# Altium project Longboard_32bit_ext.PrjPCB (part 1 of 6)
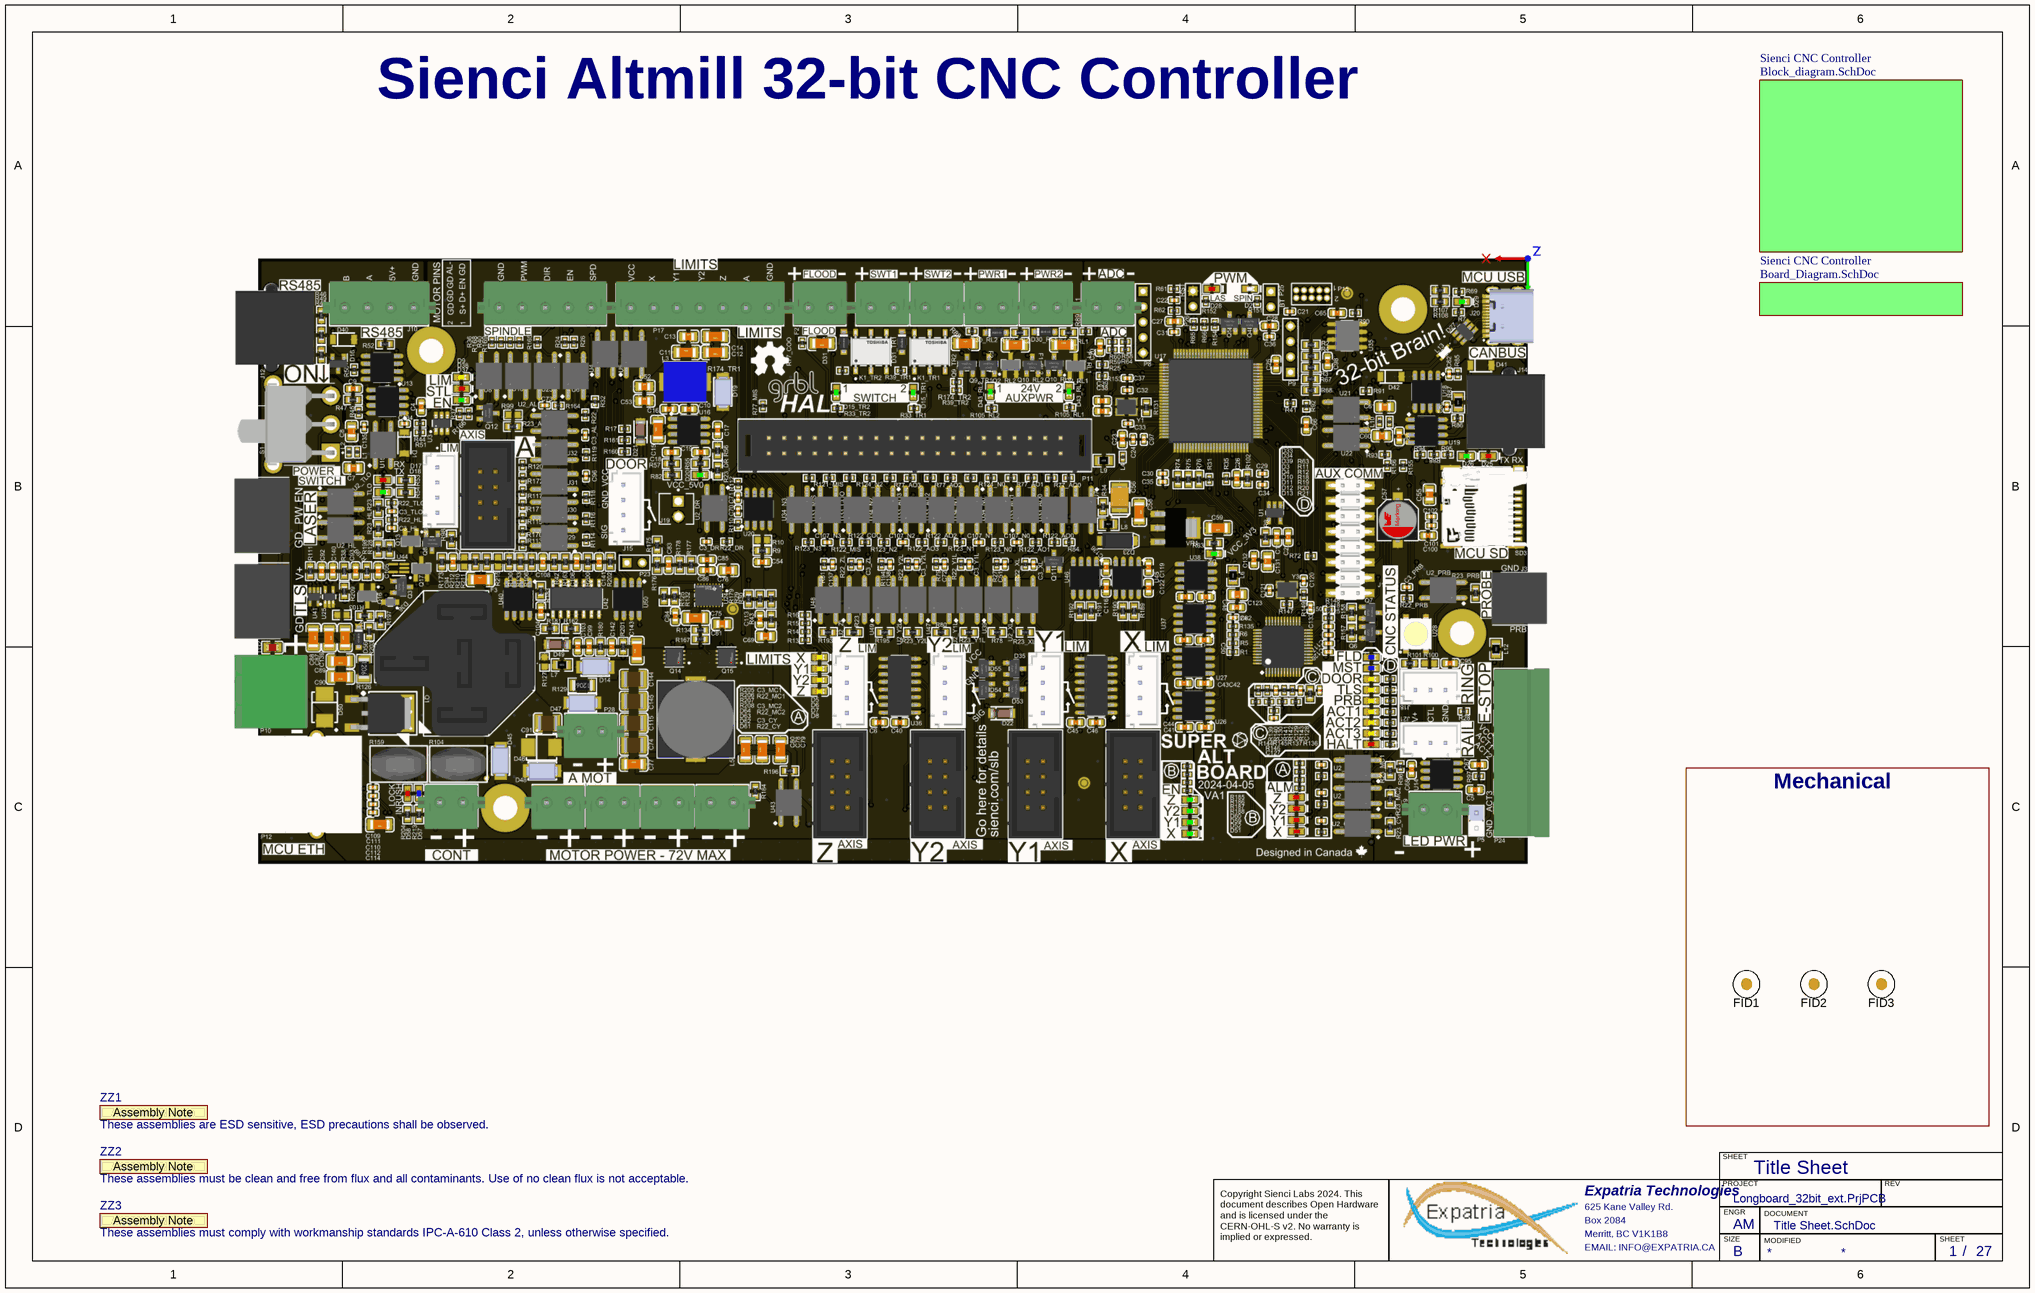
[diagram p0: Title Sheet.SchDoc]
VarRevNo: B9; Title: Sienci Longboard Ext; PCBREVNO: B9; PCBPARTNO: Sienci Longboard Ext
27 sheets, 722 parts. Net scope: hierarchical (ports join the sheet entries above them; power ports are global).
Board file: Longboard_32bit_ext.pcbdoc
Sheets:
  Title Sheet.SchDoc
    Sienci CNC Controller = Block_diagram.SchDoc
      Motion Control MCU = Longboard_32bit.SchDoc
        Microcontroller = MCU_STM32F412VGT6.SchDoc
          Keypad_layout = I2C_Keypad.SchDoc
      Limit and Homing Inputs = Limit_Switches.SchDoc
        TLO = Photocoupler12Vinput.SchDoc
        PRB = Photocoupler12Vinput.SchDoc
        XL = Photocoupler12Vinput.SchDoc
        Y1L = Photocoupler12Vinput.SchDoc
        Y2L = Photocoupler12Vinput.SchDoc
        ZL = Photocoupler12Vinput.SchDoc
        AL = Photocoupler12Vinput.SchDoc
        DR = Photocoupler12Vinput.SchDoc
      User Inputs = Misc_switches.SchDoc
        CY = Photocoupler12Vinput.SchDoc
        MC1 = Photocoupler12Vinput.SchDoc
        HL = Photocoupler12Vinput.SchDoc
        MC2 = Photocoupler12Vinput.SchDoc
      Analog/PWM/Laser Interface = Spindle_Control.SchDoc
      RS485 Interface = RS485.SchDoc
      Offboard Processing = Ethernet_Interface.SchDoc
      DC Power Regulation = DC_Power_Regulation.SchDoc
        5V_Supply = 5V_Power_Supply.SchDoc
        24V_Supply = 24V_Power_Supply.SchDoc
        DC_SW = DC_Power_Switching.SchDoc
      Stepper Drivers = Stepper_driver_group.SchDoc
      Additional IO = Aux_Outputs.SchDoc
        RL1 = Relay_Driver.SchDoc
        RL2 = Relay_Driver.SchDoc
        LED = Neopixel_Driver.SchDoc
        TR1 = Transistor_Driver.SchDoc
        MOT = External_Stepper.SchDoc
        AO0 = 5V_Digital_Out.SchDoc
        AO1 = 5V_Digital_Out.SchDoc
        AO2 = 5V_Digital_Out.SchDoc
        AO3 = 5V_Digital_Out.SchDoc
        COO = 5V_Digital_Out.SchDoc
        MIS = 5V_Digital_Out.SchDoc
        N0 = 3V3_Digital_Out.SchDoc
        N1 = 3V3_Digital_Out.SchDoc
        N2 = 3V3_Digital_Out.SchDoc
        N3 = 3V3_Digital_Out.SchDoc
        TR2 = Transistor_Driver.SchDoc
      Pendant RT Interface (optional) = CANBUS_Pendant.SchDoc
      U_Change Log = Change Log.SchDoc
      Basic USB Stream = USB_Connector.SchDoc
    Sienci CNC Controller = Board_Diagram.SchDoc

## Sheet Title Sheet.SchDoc: STM32F412 CNC
size B; Author: AM; CompanyName: Expatria Technologies; DrawnBy: A.Marles; Engineer: AM; Organization: Expatria Technolgoies; Address1: PO Box 2084; Address3: Merritt, BC V1K 1B8; Address4: Canada; DocumentNumber: 1; Revision: B9; SheetNumber: 1; SheetTotal: 27

### Parts
FID1  Fiducial  [Fiducial10-20]  (value not drawn)  (no BOM)
FID2  Fiducial  [Fiducial10-20]  (value not drawn)  (no BOM)
FID3  Fiducial  [Fiducial10-20]  (value not drawn)  (no BOM)
ZZ1  These assemblies are ESD sensitive, ESD precautions shall be observed.  [AssemblyNote]  (graphical)
ZZ2  These assemblies must be clean and free from flux and all contaminants. Use of no clean flux is not acceptable.  [AssemblyNote]  (graphical)
ZZ3  These assemblies must comply with workmanship standards IPC-A-610 Class 2, unless otherwise specified.  [AssemblyNote]  (graphical)

### Blocks framed on the sheet
Mechanical: FID1-FID3

### Sub-sheets
Sienci CNC Controller = Block_diagram.SchDoc: no entries
Sienci CNC Controller = Board_Diagram.SchDoc: no entries

### Notes on the sheet
- Sienci Altmill 32-bit CNC Controller
- Title Sheet
- SHEET
- Expatria Technologies
- 625 Kane Valley Rd.
- Box 2084
- Merritt, BC V1K1B8
- PROJECT
- SIZE
- ENGR
- MODIFIED
- DOCUMENT
- REV
- Copyright Sienci Labs 2024. This document describes Open Hardware and is licensed under the CERN-OHL-S v2. No warranty is implied or expressed.
- EMAIL: INFO@EXPATRIA.CA
- B
- /
- (in symbol AssemblyNote) Assembly Note

### Library data of the parts
FID1-FID3 = Fiducial: FIDUCIAL NO ASSEMBLY; Manufacturer 1: NONE; Manufacturer Part Number 1: NONE; Value: Fiducial; Manufacturer: NONE; Manufacturer Part Number: NONE
ZZ1-ZZ3 = AssemblyNote: SymbolCreator: codlsc; SymbolVersion: 2010-05-18; CompType: AssemblyNote; ClassName: AssemblyNote; Publisher: Texas Instruments; LatestRevisionDate: 2012-06-14; LatestRevisionNote: Initial Version; Alternate Manufacturer: -; Alternate PartNumber: -; Parameter 1: *

## Sheet Block_diagram.SchDoc: Sienci Longboard Ext
size C; Author: AM; CompanyName: Expatria Technologies; DrawnBy: A.Marles; Engineer: AM; Organization: Expatria Technolgoies; Address1: PO Box 2084; Address3: Merritt, BC V1K 1B8; Address4: Canada; DocumentNumber: 3; Revision: B9; SheetNumber: 3; SheetTotal: 27
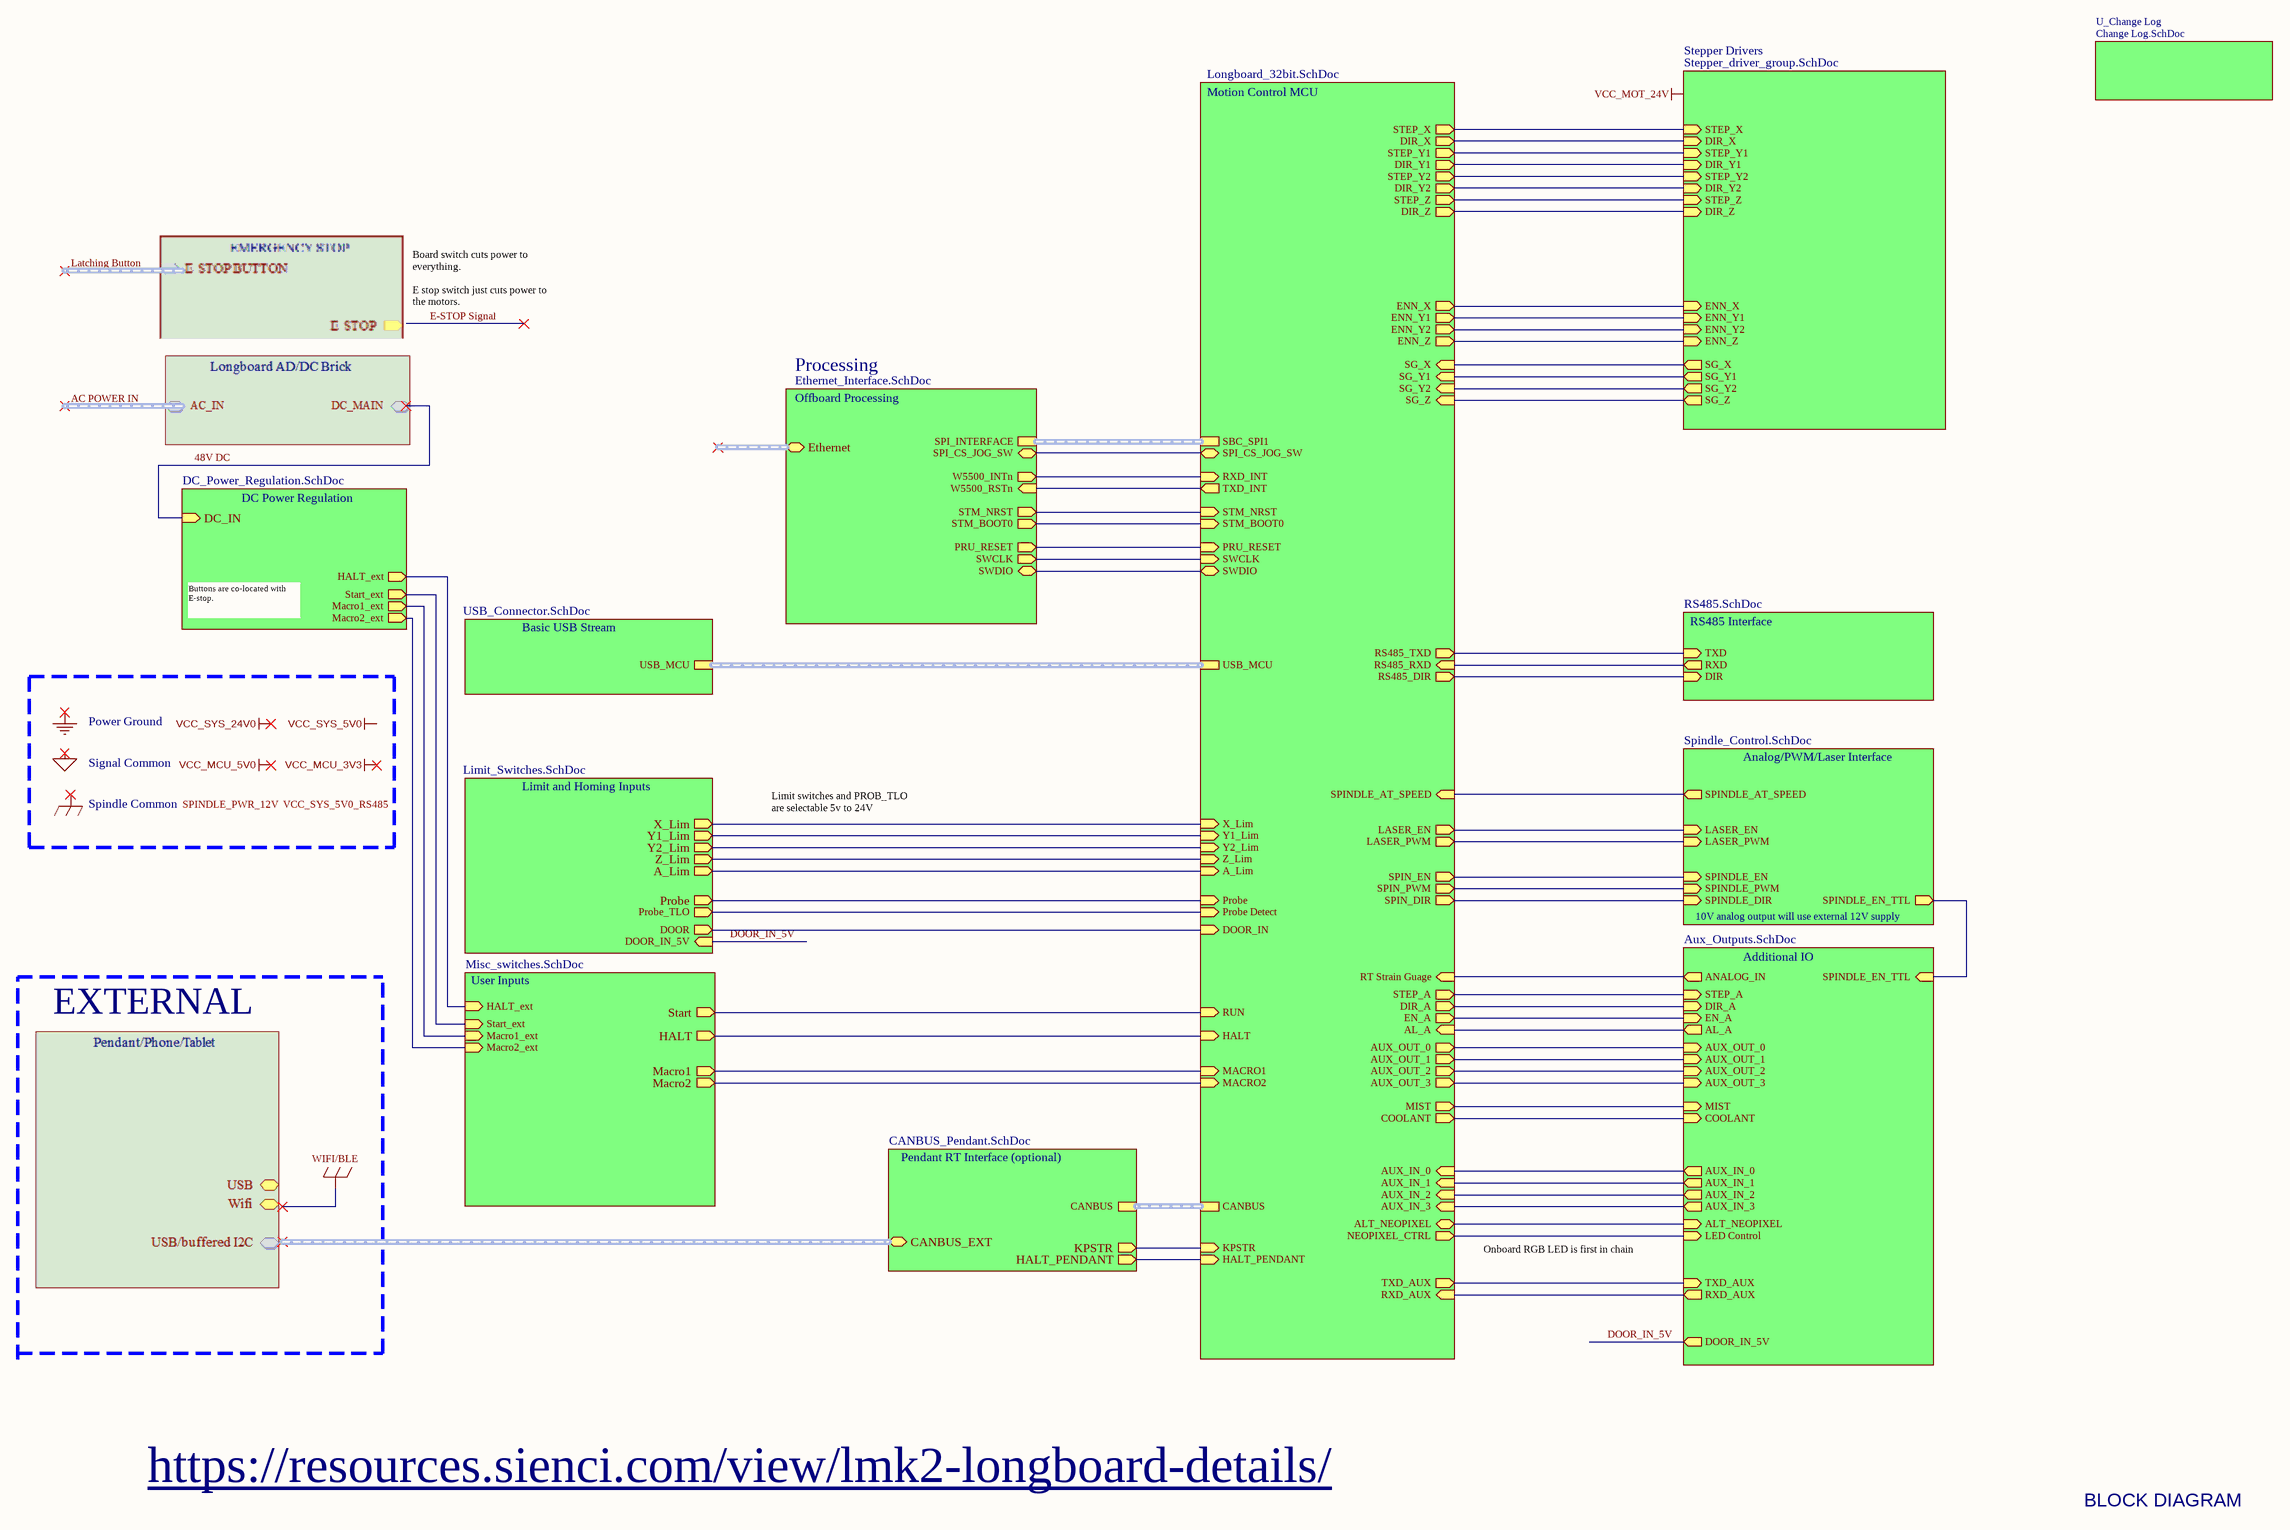
[diagram p1: Block_diagram.SchDoc]

### Sub-sheets
Additional IO = Aux_Outputs.SchDoc: STEP_A (in), DIR_A (in), AUX_OUT_0 (in), AUX_OUT_1 (in), AUX_OUT_2 (in), AUX_OUT_3 (in), AUX_IN_0 (out), AUX_IN_1 (out), AUX_IN_2 (out), AUX_IN_3 (out), LED Control (in), EN_A (in), AL_A (out), RXD_AUX (out), TXD_AUX (in), ANALOG_IN (out), COOLANT (in), MIST (in), SPINDLE_EN_TTL (in), ALT_NEOPIXEL (in), DOOR_IN_5V (out)
Analog/PWM/Laser Interface = Spindle_Control.SchDoc: LASER_PWM (in), LASER_EN (in), SPINDLE_PWM (in), SPINDLE_EN (in), SPINDLE_DIR (in), SPINDLE_AT_SPEED (out), SPINDLE_EN_TTL (out)
Basic USB Stream = USB_Connector.SchDoc: USB_MCU (harness USB2.0)
DC Power Regulation = DC_Power_Regulation.SchDoc: DC_IN (in), Start_ext (out), Macro1_ext (out), Macro2_ext (out), HALT_ext (out)
Limit and Homing Inputs = Limit_Switches.SchDoc: X_Lim (out), Y1_Lim (out), Y2_Lim (out), Z_Lim (out), A_Lim (out), Probe (out), Probe_TLO (out), DOOR (out), DOOR_IN_5V (in)
Motion Control MCU = Longboard_32bit.SchDoc: RS485_TXD (out), SPIN_PWM (out), X_Lim (in), Y1_Lim (in), Y2_Lim (in), Z_Lim (in), SPINDLE_AT_SPEED (in), RUN (in), A_Lim (in), SPIN_EN (out), Probe (in), RT Strain Guage (in), COOLANT (out), MIST (out), Probe Detect (in), STEP_X (out), DIR_X (out), STEP_Y1 (out), DIR_Y1 (out), STEP_Z (out), DIR_Z (out), STEP_Y2 (out), DIR_Y2 (out), STEP_A (out), DIR_A (out), SPIN_DIR (out), AUX_OUT_0 (out), AUX_OUT_1 (out), AUX_OUT_2 (out), AUX_OUT_3 (out), AUX_IN_0 (in), AUX_IN_1 (in), AUX_IN_2 (in), AUX_IN_3 (in), NEOPIXEL_CTRL (out), KPSTR (in), HALT (in), ENN_X (out), ENN_Y1 (out), ENN_Z (out), ENN_Y2 (out), SG_X (in), SG_Y1 (in), SG_Z (in), SG_Y2 (in), EN_A (out), AL_A (in), SPI_CS_JOG_SW (bidir), LASER_PWM (out), LASER_EN (out), MACRO1 (in), MACRO2 (in), RS485_RXD (in), RS485_DIR (out), SBC_SPI1 (harness SPI), STM_NRST (in), STM_BOOT0 (in), RXD_INT (in), TXD_INT (out), CANBUS (harness CANBUS), RXD_AUX (in), TXD_AUX (out), PRU_RESET (in), SWCLK (in), SWDIO (bidir), HALT_PENDANT (in), DOOR_IN (in), ALT_NEOPIXEL (bidir), USB_MCU (harness USB2)
Offboard Processing = Ethernet_Interface.SchDoc: SPI_INTERFACE (harness DIFF_PAIR), Ethernet (bidir), SPI_CS_JOG_SW (bidir), STM_NRST (out), STM_BOOT0 (out), SWCLK (out), SWDIO (bidir), PRU_RESET (out), W5500_INTn (out), W5500_RSTn (in)
Pendant RT Interface (optional) = CANBUS_Pendant.SchDoc: CANBUS_EXT (bidir), KPSTR (out), HALT_PENDANT (out), CANBUS (harness CANBUS)
RS485 Interface = RS485.SchDoc: DIR (in), RXD (out), TXD (in)
Stepper Drivers = Stepper_driver_group.SchDoc: STEP_X (in), DIR_X (in), STEP_Y1 (in), DIR_Y1 (in), STEP_Z (in), DIR_Z (in), STEP_Y2 (in), DIR_Y2 (in), ENN_X (in), ENN_Y1 (in), ENN_Z (in), ENN_Y2 (in), SG_X (out), SG_Y1 (out), SG_Z (out), SG_Y2 (out)
U_Change Log = Change Log.SchDoc: no entries
User Inputs = Misc_switches.SchDoc: HALT (out), Start (out), Macro1 (out), Macro2 (out), Start_ext (in), Macro1_ext (in), HALT_ext (in), Macro2_ext (in)

### Nets
48V DC: sheet DC Power Regulation/DC_IN
A_LIM: sheet Motion Control MCU/A_Lim, sheet Limit and Homing Inputs/A_Lim
AL_A: sheet Motion Control MCU/AL_A, sheet Additional IO/AL_A
ANALOG_IN: sheet Motion Control MCU/RT Strain Guage, sheet Additional IO/ANALOG_IN
AUX_IN_0: sheet Motion Control MCU/AUX_IN_0, sheet Additional IO/AUX_IN_0
AUX_IN_1: sheet Motion Control MCU/AUX_IN_1, sheet Additional IO/AUX_IN_1
AUX_IN_2: sheet Motion Control MCU/AUX_IN_2, sheet Additional IO/AUX_IN_2
AUX_IN_3: sheet Motion Control MCU/AUX_IN_3, sheet Additional IO/AUX_IN_3
AUXOUT_0: sheet Motion Control MCU/AUX_OUT_0, sheet Additional IO/AUX_OUT_0
AUXOUT_1: sheet Motion Control MCU/AUX_OUT_1, sheet Additional IO/AUX_OUT_1
AUXOUT_2: sheet Motion Control MCU/AUX_OUT_2, sheet Additional IO/AUX_OUT_2
AUXOUT_3: sheet Motion Control MCU/AUX_OUT_3, sheet Additional IO/AUX_OUT_3
COOLANT: sheet Motion Control MCU/COOLANT, sheet Additional IO/COOLANT
CYC/ST: sheet Motion Control MCU/RUN, sheet User Inputs/Start
DIR: sheet Motion Control MCU/RS485_DIR, sheet RS485 Interface/DIR
DIR_A: sheet Motion Control MCU/DIR_A, sheet Additional IO/DIR_A
DIR_X: sheet Motion Control MCU/DIR_X, sheet Stepper Drivers/DIR_X
DIR_Y1: sheet Motion Control MCU/DIR_Y1, sheet Stepper Drivers/DIR_Y1
DIR_Y2: sheet Motion Control MCU/DIR_Y2, sheet Stepper Drivers/DIR_Y2
DIR_Z: sheet Motion Control MCU/DIR_Z, sheet Stepper Drivers/DIR_Z
DOOR: sheet Motion Control MCU/DOOR_IN, sheet Limit and Homing Inputs/DOOR
DOOR_IN_5V: sheet Limit and Homing Inputs/DOOR_IN_5V, sheet Additional IO/DOOR_IN_5V
ENN_X: sheet Motion Control MCU/ENN_X, sheet Stepper Drivers/ENN_X
ENN_Y1: sheet Motion Control MCU/ENN_Y1, sheet Motion Control MCU/ENN_Y2, sheet Stepper Drivers/ENN_Y1, sheet Stepper Drivers/ENN_Y2
ENN_Z: sheet Motion Control MCU/ENN_Z, sheet Stepper Drivers/ENN_Z
HALT: sheet Motion Control MCU/HALT, sheet User Inputs/HALT
HALT_ext: sheet User Inputs/HALT_ext, sheet DC Power Regulation/HALT_ext
HALT_PENDANT: sheet Motion Control MCU/HALT_PENDANT, sheet Pendant RT Interface (optional)/HALT_PENDANT
KPSTR: sheet Motion Control MCU/KPSTR, sheet Pendant RT Interface (optional)/KPSTR
LASER_EN: sheet Motion Control MCU/LASER_EN, sheet Analog/PWM/Laser Interface/LASER_EN
Laser_PWM: sheet Motion Control MCU/LASER_PWM, sheet Analog/PWM/Laser Interface/LASER_PWM
LED Control: sheet Motion Control MCU/NEOPIXEL_CTRL, sheet Additional IO/LED Control
MAC1: sheet Motion Control MCU/MACRO1, sheet User Inputs/Macro1
MAC2: sheet Motion Control MCU/MACRO2, sheet User Inputs/Macro2
Macro1_ext: sheet User Inputs/Macro1_ext, sheet DC Power Regulation/Macro1_ext
Macro2_ext: sheet User Inputs/Macro2_ext, sheet DC Power Regulation/Macro2_ext
MIST: sheet Motion Control MCU/MIST, sheet Additional IO/MIST
PRB_TLO: sheet Motion Control MCU/Probe Detect, sheet Limit and Homing Inputs/Probe_TLO
PROBE: sheet Motion Control MCU/Probe, sheet Limit and Homing Inputs/Probe
PRU_RESET: sheet Motion Control MCU/PRU_RESET, sheet Offboard Processing/PRU_RESET
RXD: sheet Motion Control MCU/RS485_RXD, sheet RS485 Interface/RXD
RXD_AUX: sheet Motion Control MCU/RXD_AUX, sheet Additional IO/RXD_AUX
RXD_INT: sheet Motion Control MCU/RXD_INT, sheet Offboard Processing/W5500_INTn
SG_X: sheet Motion Control MCU/SG_X, sheet Stepper Drivers/SG_X
SG_Y1: sheet Motion Control MCU/SG_Y1, sheet Stepper Drivers/SG_Y1
SG_Y2: sheet Motion Control MCU/SG_Y2, sheet Stepper Drivers/SG_Y2
SG_Z: sheet Motion Control MCU/SG_Z, sheet Stepper Drivers/SG_Z
SPI_CS_JOG_SW: sheet Motion Control MCU/SPI_CS_JOG_SW, sheet Offboard Processing/SPI_CS_JOG_SW
SPINDLE_AT_SPEED: sheet Motion Control MCU/SPINDLE_AT_SPEED, sheet Analog/PWM/Laser Interface/SPINDLE_AT_SPEED
SPINDLE_DIR: sheet Motion Control MCU/SPIN_DIR, sheet Analog/PWM/Laser Interface/SPINDLE_DIR
SPINDLE_EN: sheet Motion Control MCU/SPIN_EN, sheet Analog/PWM/Laser Interface/SPINDLE_EN
SPINDLE_EN_5V: sheet Analog/PWM/Laser Interface/SPINDLE_EN_TTL, sheet Additional IO/SPINDLE_EN_TTL
SPINDLE_PWM: sheet Motion Control MCU/SPIN_PWM, sheet Analog/PWM/Laser Interface/SPINDLE_PWM
Start_ext: sheet User Inputs/Start_ext, sheet DC Power Regulation/Start_ext
STEP_A: sheet Motion Control MCU/STEP_A, sheet Additional IO/STEP_A
STEP_EN_A: sheet Motion Control MCU/EN_A, sheet Additional IO/EN_A
STEP_X: sheet Motion Control MCU/STEP_X, sheet Stepper Drivers/STEP_X
STEP_Y1: sheet Motion Control MCU/STEP_Y1, sheet Stepper Drivers/STEP_Y1
STEP_Y2: sheet Motion Control MCU/STEP_Y2, sheet Stepper Drivers/STEP_Y2
STEP_Z: sheet Motion Control MCU/STEP_Z, sheet Stepper Drivers/STEP_Z
STM_BOOT0: sheet Motion Control MCU/STM_BOOT0, sheet Offboard Processing/STM_BOOT0
STM_RESET: sheet Motion Control MCU/STM_NRST, sheet Offboard Processing/STM_NRST
SWCLK: sheet Motion Control MCU/SWCLK, sheet Offboard Processing/SWCLK
SWDIO: sheet Motion Control MCU/SWDIO, sheet Motion Control MCU/ALT_NEOPIXEL, sheet Offboard Processing/SWDIO, sheet Additional IO/ALT_NEOPIXEL
TXD: sheet Motion Control MCU/RS485_TXD, sheet RS485 Interface/TXD
TXD_AUX: sheet Motion Control MCU/TXD_AUX, sheet Additional IO/TXD_AUX
TXD_INT: sheet Motion Control MCU/TXD_INT, sheet Offboard Processing/W5500_RSTn
X_LIM: sheet Motion Control MCU/X_Lim, sheet Limit and Homing Inputs/X_Lim
Y2_LIM: sheet Motion Control MCU/Y2_Lim, sheet Limit and Homing Inputs/Y2_Lim
Y_LIM: sheet Motion Control MCU/Y1_Lim, sheet Limit and Homing Inputs/Y1_Lim
Z_LIM: sheet Motion Control MCU/Z_Lim, sheet Limit and Homing Inputs/Z_Lim

### Buses and harness runs
harness sheet Basic USB Stream/USB_MCU = sheet Motion Control MCU/USB_MCU
harness sheet Motion Control MCU/CANBUS = sheet Pendant RT Interface (optional)/CANBUS
harness sheet Motion Control MCU/SBC_SPI1 = sheet Offboard Processing/SPI_INTERFACE

### Notes on the sheet
- Board switch cuts power to everything.
  E stop switch just cuts power to the motors.
- Processing
- Buttons are co-located with E-stop.
- Power Ground
- Spindle Common
- Signal Common
- SPINDLE_PWR_12V
- VCC_SYS_5V0_RS485
- Limit switches and PROB_TLO are selectable 5v to 24V
- 10V analog output will use external 12V supply
- EXTERNAL
- Onboard RGB LED is first in chain
- https://resources.sienci.com/view/lmk2-longboard-details/
- BLOCK DIAGRAM
- Labels drawn without touching a wire or pin: GND, MCU_GND, SPIN_GND, VCC_MCU_3V3, VCC_MCU_5V0, VCC_MOT_24V, VCC_SYS_5V0, VCC_SYS_24V0
- Expatria Technologies
- SHEET
- PROJECT
- REV
- EMAIL: INFO@EXPATRIA.CA
- 625 Kane Valley Rd.
- Box 2084
- Merritt, BC V1K1B8
- SIZE
- ENGR
- C
- MODIFIED
- DOCUMENT
- /
- Copyright Sienci Labs 2024. This document describes Open Hardware and is licensed under the CERN-OHL-S v2. No warranty is implied or expressed.

## Sheet Longboard_32bit.SchDoc: RP2040 CNC
size B; Author: AM; CompanyName: Expatria Technologies; DrawnBy: A.Marles; Engineer: AM; Organization: Expatria Technolgoies; Address1: PO Box 2084; Address3: Merritt, BC V1K 1B8; Address4: Canada; DocumentNumber: 4; Revision: B9; SheetNumber: 4; SheetTotal: 27
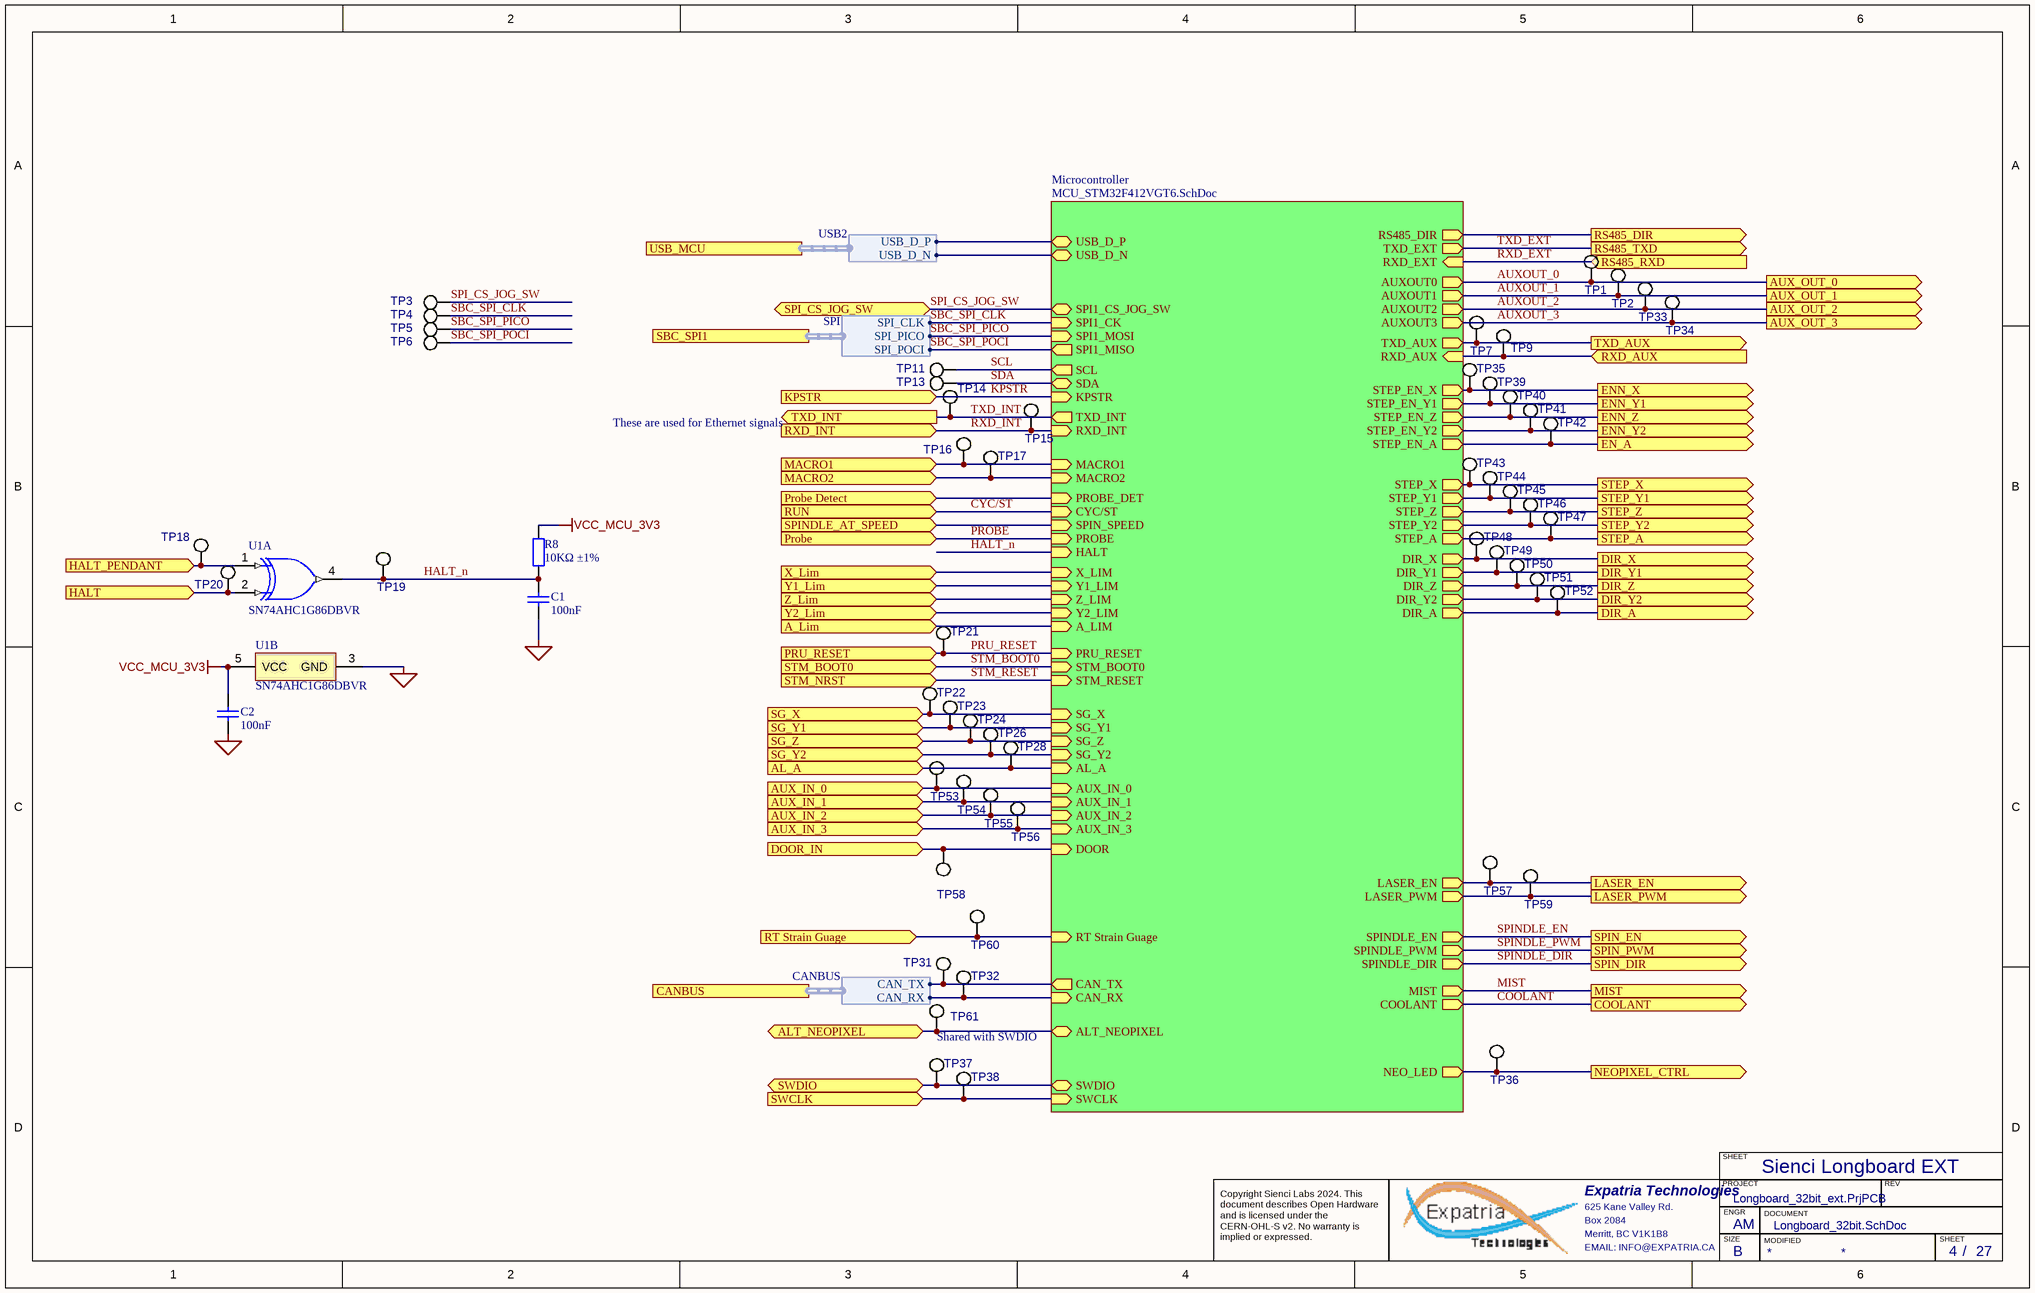
[diagram p2: Longboard_32bit.SchDoc]

### Parts
C1  100nF  [0603_C]
C2  100nF  [0603_C]
R8  10KΩ ±1%  [0603_R]
TP1  TESTPOINT  [TP/SMT]  (value not drawn)  (no BOM)
TP2  TESTPOINT  [TP/SMT]  (value not drawn)  (no BOM)
TP3  TESTPOINT  [TP/SMT]  (value not drawn)  (no BOM)
TP4  TESTPOINT  [TP/SMT]  (value not drawn)  (no BOM)
TP5  TESTPOINT  [TP/SMT]  (value not drawn)  (no BOM)
TP6  TESTPOINT  [TP/SMT]  (value not drawn)  (no BOM)
TP7  TESTPOINT  [TP/SMT]  (value not drawn)  (no BOM)
TP9  TESTPOINT  [TP/SMT]  (value not drawn)  (no BOM)
TP11  TESTPOINT  [TP/SMT]  (value not drawn)  (no BOM)
TP13  TESTPOINT  [TP/SMT]  (value not drawn)  (no BOM)
TP14  TESTPOINT  [TP/SMT]  (value not drawn)  (no BOM)
TP15  TESTPOINT  [TP/SMT]  (value not drawn)  (no BOM)
TP16  TESTPOINT  [TP/SMT]  (value not drawn)  (no BOM)
TP17  TESTPOINT  [TP/SMT]  (value not drawn)  (no BOM)
TP18  TESTPOINT  [TP/SMT]  (value not drawn)  (no BOM)
TP19  TESTPOINT  [TP/SMT]  (value not drawn)  (no BOM)
TP20  TESTPOINT  [TP/SMT]  (value not drawn)  (no BOM)
TP21  TESTPOINT  [TP/SMT]  (value not drawn)  (no BOM)
TP22  TESTPOINT  [TP/SMT]  (value not drawn)  (no BOM)
TP23  TESTPOINT  [TP/SMT]  (value not drawn)  (no BOM)
TP24  TESTPOINT  [TP/SMT]  (value not drawn)  (no BOM)
TP26  TESTPOINT  [TP/SMT]  (value not drawn)  (no BOM)
TP28  TESTPOINT  [TP/SMT]  (value not drawn)  (no BOM)
TP31  TESTPOINT  [TP/SMT]  (value not drawn)  (no BOM)
TP32  TESTPOINT  [TP/SMT]  (value not drawn)  (no BOM)
TP33  TESTPOINT  [TP/SMT]  (value not drawn)  (no BOM)
TP34  TESTPOINT  [TP/SMT]  (value not drawn)  (no BOM)
TP35  TESTPOINT  [TP/SMT]  (value not drawn)  (no BOM)
TP36  TESTPOINT  [TP/SMT]  (value not drawn)  (no BOM)
TP37  TESTPOINT  [TP/SMT]  (value not drawn)  (no BOM)
TP38  TESTPOINT  [TP/SMT]  (value not drawn)  (no BOM)
TP39  TESTPOINT  [TP/SMT]  (value not drawn)  (no BOM)
TP40  TESTPOINT  [TP/SMT]  (value not drawn)  (no BOM)
TP41  TESTPOINT  [TP/SMT]  (value not drawn)  (no BOM)
TP42  TESTPOINT  [TP/SMT]  (value not drawn)  (no BOM)
TP43  TESTPOINT  [TP/SMT]  (value not drawn)  (no BOM)
TP44  TESTPOINT  [TP/SMT]  (value not drawn)  (no BOM)
TP45  TESTPOINT  [TP/SMT]  (value not drawn)  (no BOM)
TP46  TESTPOINT  [TP/SMT]  (value not drawn)  (no BOM)
TP47  TESTPOINT  [TP/SMT]  (value not drawn)  (no BOM)
TP48  TESTPOINT  [TP/SMT]  (value not drawn)  (no BOM)
TP49  TESTPOINT  [TP/SMT]  (value not drawn)  (no BOM)
TP50  TESTPOINT  [TP/SMT]  (value not drawn)  (no BOM)
TP51  TESTPOINT  [TP/SMT]  (value not drawn)  (no BOM)
TP52  TESTPOINT  [TP/SMT]  (value not drawn)  (no BOM)
TP53  TESTPOINT  [TP/SMT]  (value not drawn)  (no BOM)
TP54  TESTPOINT  [TP/SMT]  (value not drawn)  (no BOM)
TP55  TESTPOINT  [TP/SMT]  (value not drawn)  (no BOM)
TP56  TESTPOINT  [TP/SMT]  (value not drawn)  (no BOM)
TP57  TESTPOINT  [TP/SMT]  (value not drawn)  (no BOM)
TP58  TESTPOINT  [TP/SMT]  (value not drawn)  (no BOM)
TP59  TESTPOINT  [TP/SMT]  (value not drawn)  (no BOM)
TP60  TESTPOINT  [TP/SMT]  (value not drawn)  (no BOM)
TP61  TESTPOINT  [TP/SMT]  (value not drawn)  (no BOM)
U1  SN74AHC1G86DBVR  [SOT95P280X145-5N]  (parts A,B of 2)

### Sub-sheets
Microcontroller = MCU_STM32F412VGT6.SchDoc: USB_D_P (bidir), DIR_A (out), RXD_INT (in), DIR_Y1 (out), USB_D_N (bidir), DIR_X (out), STEP_A (out), TXD_INT (out), STEP_Y2 (out), SPI1_CK (in), STEP_Z (out), STEP_Y1 (out), SPI1_MISO (out), SPI1_MOSI (in), SPIN_SPEED (in), STEP_X (out), CYC/ST (in), SPI1_CS_JOG_SW (bidir), PROBE (in), AUXOUT3 (out), TXD_EXT (out), SDA (bidir), AUXOUT2 (out), AUXOUT0 (out), Y2_LIM (in), SCL (out), DIR_Z (out), KPSTR (in), RXD_EXT (in), HALT (in), AUXOUT1 (out), DIR_Y2 (out), PRU_RESET (in), X_LIM (in), Z_LIM (in), STM_BOOT0 (in), Y1_LIM (in), STEP_EN_X (out), A_LIM (in), STM_RESET (in), STEP_EN_Y1 (out), LASER_PWM (out), LASER_EN (out), SPINDLE_PWM (out), SPINDLE_DIR (out), SPINDLE_EN (out), STEP_EN_Z (out), STEP_EN_Y2 (out), STEP_EN_A (out), SG_Y2 (in), SG_Z (in), SG_Y1 (in), SG_X (in), AL_A (in), MIST (out), COOLANT (out), AUX_IN_0 (in), MACRO1 (in), MACRO2 (in), AUX_IN_1 (in), AUX_IN_2 (in), AUX_IN_3 (in), PROBE_DET (in), RS485_DIR (out), NEO_LED (out), RT Strain Guage (in), CAN_TX (out), CAN_RX (in), SWCLK (in), SWDIO (bidir), RXD_AUX (in), TXD_AUX (out), DOOR (in), ALT_NEOPIXEL (bidir)

### Ports
A_Lim (in), AL_A (in), ALT_NEOPIXEL (bidir), AUX_IN_0 (in), AUX_IN_1 (in), AUX_IN_2 (in), AUX_IN_3 (in), AUX_OUT_0 (out), AUX_OUT_1 (out), AUX_OUT_2 (out), AUX_OUT_3 (out), CANBUS (harness CANBUS), COOLANT (out), DIR_A (out), DIR_X (out), DIR_Y1 (out), DIR_Y2 (out), DIR_Z (out), DOOR_IN (in), EN_A (out), ENN_X (out), ENN_Y1 (out), ENN_Y2 (out), ENN_Z (out), HALT (in), HALT_PENDANT (in), KPSTR (in), LASER_EN (out), LASER_PWM (out), MACRO1 (in), MACRO2 (in), MIST (out), NEOPIXEL_CTRL (out), Probe (in), Probe Detect (in), PRU_RESET (in), RS485_DIR (out), RS485_RXD (in), RS485_TXD (out), RT Strain Guage (in), RUN (in), RXD_AUX (in), RXD_INT (in), SBC_SPI1 (harness SPI), SG_X (in), SG_Y1 (in), SG_Y2 (in), SG_Z (in), SPI_CS_JOG_SW (bidir), SPIN_DIR (out), SPIN_EN (out), SPIN_PWM (out), SPINDLE_AT_SPEED (in), STEP_A (out), STEP_X (out), STEP_Y1 (out), STEP_Y2 (out), STEP_Z (out), STM_BOOT0 (in), STM_NRST (in), SWCLK (in), SWDIO (bidir), TXD_AUX (out), TXD_INT (out), USB_MCU (harness USB2), X_Lim (in), Y1_Lim (in), Y2_Lim (in), Z_Lim (in)

### Harnesses
SPI: SPI_CLK, SPI_PICO, SPI_POCI
USB2: USB_D_P, USB_D_N
CANBUS: CAN_TX, CAN_RX

### Nets
MCU_GND: C1.1 C2.1 U1.3(GND)
VCC_MCU_3V3: C2.2 R8.2 U1.5(VCC)
A_LIM: port A_Lim, sheet Microcontroller/A_LIM
AL_A: TP28.1 ; port AL_A, sheet Microcontroller/AL_A
ANALOG_IN: TP60.1 ; port RT Strain Guage, sheet Microcontroller/RT Strain Guage
AUX_IN_0: TP53.1 ; port AUX_IN_0, sheet Microcontroller/AUX_IN_0
AUX_IN_1: TP54.1 ; port AUX_IN_1, sheet Microcontroller/AUX_IN_1
AUX_IN_2: TP55.1 ; port AUX_IN_2, sheet Microcontroller/AUX_IN_2
AUX_IN_3: TP56.1 ; port AUX_IN_3, sheet Microcontroller/AUX_IN_3
AUXOUT_0: TP1.1 ; port AUX_OUT_0, sheet Microcontroller/AUXOUT0
AUXOUT_1: TP2.1 ; port AUX_OUT_1, sheet Microcontroller/AUXOUT1
AUXOUT_2: TP33.1 ; port AUX_OUT_2, sheet Microcontroller/AUXOUT2
AUXOUT_3: TP34.1 ; port AUX_OUT_3, sheet Microcontroller/AUXOUT3
CAN_RX: TP32.1 ; sheet Microcontroller/CAN_RX, port CANBUS.CAN_RX
CAN_TX: TP31.1 ; sheet Microcontroller/CAN_TX, port CANBUS.CAN_TX
COOLANT: port COOLANT, sheet Microcontroller/COOLANT
CYC/ST: port RUN, sheet Microcontroller/CYC/ST
DIR: port RS485_DIR, sheet Microcontroller/RS485_DIR
DIR_A: TP52.1 ; port DIR_A, sheet Microcontroller/DIR_A
DIR_X: TP48.1 ; port DIR_X, sheet Microcontroller/DIR_X
DIR_Y1: TP49.1 ; port DIR_Y1, sheet Microcontroller/DIR_Y1
DIR_Y2: TP51.1 ; port DIR_Y2, sheet Microcontroller/DIR_Y2
DIR_Z: TP50.1 ; port DIR_Z, sheet Microcontroller/DIR_Z
DOOR: TP58.1 ; port DOOR_IN, sheet Microcontroller/DOOR
ENN_X: TP35.1 ; port ENN_X, sheet Microcontroller/STEP_EN_X
ENN_Y1: TP39.1 TP41.1 ; port ENN_Y1, port ENN_Y2, sheet Microcontroller/STEP_EN_Y1, sheet Microcontroller/STEP_EN_Y2
ENN_Z: TP40.1 ; port ENN_Z, sheet Microcontroller/STEP_EN_Z
HALT: TP20.1 U1.2(B) ; port HALT
HALT_n: C1.2 R8.1 TP19.1 U1.4(Y) ; sheet Microcontroller/HALT
HALT_PENDANT: TP18.1 U1.1(A) ; port HALT_PENDANT
KPSTR: port KPSTR, sheet Microcontroller/KPSTR
LASER_EN: TP57.1 ; port LASER_EN, sheet Microcontroller/LASER_EN
Laser_PWM: TP59.1 ; port LASER_PWM, sheet Microcontroller/LASER_PWM
LED Control: TP36.1 ; port NEOPIXEL_CTRL, sheet Microcontroller/NEO_LED
MAC1: TP16.1 ; port MACRO1, sheet Microcontroller/MACRO1
MAC2: TP17.1 ; port MACRO2, sheet Microcontroller/MACRO2
MIST: port MIST, sheet Microcontroller/MIST
PRB_TLO: port Probe Detect, sheet Microcontroller/PROBE_DET
PROBE: port Probe, sheet Microcontroller/PROBE
PRU_RESET: TP21.1 ; port PRU_RESET, sheet Microcontroller/PRU_RESET
RXD_AUX: TP9.1 ; port RXD_AUX, sheet Microcontroller/RXD_AUX
RXD_EXT: port RS485_RXD, sheet Microcontroller/RXD_EXT  [project net RXD]
RXD_INT: TP15.1 ; port RXD_INT, sheet Microcontroller/RXD_INT
SBC_SPI_CLK: TP4.1 ; sheet Microcontroller/SPI1_CK, port SBC_SPI1.SPI_CLK
SBC_SPI_PICO: TP5.1 ; sheet Microcontroller/SPI1_MOSI, port SBC_SPI1.SPI_PICO
SBC_SPI_POCI: TP6.1 ; sheet Microcontroller/SPI1_MISO, port SBC_SPI1.SPI_POCI
SCL: TP11.1 ; sheet Microcontroller/SCL
SDA: TP13.1 ; sheet Microcontroller/SDA
SG_X: TP22.1 ; port SG_X, sheet Microcontroller/SG_X
SG_Y1: TP23.1 ; port SG_Y1, sheet Microcontroller/SG_Y1
SG_Y2: TP26.1 ; port SG_Y2, sheet Microcontroller/SG_Y2
SG_Z: TP24.1 ; port SG_Z, sheet Microcontroller/SG_Z
SPI_CS_JOG_SW: TP3.1 ; port SPI_CS_JOG_SW, sheet Microcontroller/SPI1_CS_JOG_SW
SPINDLE_AT_SPEED: port SPINDLE_AT_SPEED, sheet Microcontroller/SPIN_SPEED
SPINDLE_DIR: port SPIN_DIR, sheet Microcontroller/SPINDLE_DIR
SPINDLE_EN: port SPIN_EN, sheet Microcontroller/SPINDLE_EN
SPINDLE_PWM: port SPIN_PWM, sheet Microcontroller/SPINDLE_PWM
STEP_A: TP47.1 ; port STEP_A, sheet Microcontroller/STEP_A
STEP_EN_A: TP42.1 ; port EN_A, sheet Microcontroller/STEP_EN_A
STEP_X: TP43.1 ; port STEP_X, sheet Microcontroller/STEP_X
STEP_Y1: TP44.1 ; port STEP_Y1, sheet Microcontroller/STEP_Y1
STEP_Y2: TP46.1 ; port STEP_Y2, sheet Microcontroller/STEP_Y2
STEP_Z: TP45.1 ; port STEP_Z, sheet Microcontroller/STEP_Z
STM_BOOT0: port STM_BOOT0, sheet Microcontroller/STM_BOOT0
STM_RESET: port STM_NRST, sheet Microcontroller/STM_RESET
SWCLK: TP38.1 ; port SWCLK, sheet Microcontroller/SWCLK
SWDIO: TP37.1 TP61.1 ; port SWDIO, port ALT_NEOPIXEL, sheet Microcontroller/SWDIO, sheet Microcontroller/ALT_NEOPIXEL
TXD_AUX: TP7.1 ; port TXD_AUX, sheet Microcontroller/TXD_AUX
TXD_EXT: port RS485_TXD, sheet Microcontroller/TXD_EXT  [project net TXD]
TXD_INT: TP14.1 ; port TXD_INT, sheet Microcontroller/TXD_INT
USB_D_N: sheet Microcontroller/USB_D_N, port USB_MCU.USB_D_N
USB_D_P: sheet Microcontroller/USB_D_P, port USB_MCU.USB_D_P
X_LIM: port X_Lim, sheet Microcontroller/X_LIM
Y2_LIM: port Y2_Lim, sheet Microcontroller/Y2_LIM
Y_LIM: port Y1_Lim, sheet Microcontroller/Y1_LIM
Z_LIM: port Z_Lim, sheet Microcontroller/Z_LIM

### Notes on the sheet
- These are used for Ethernet signals
- (near TP61) Shared with SWDIO
- Sienci Longboard EXT
- SHEET
- Expatria Technologies
- 625 Kane Valley Rd.
- Box 2084
- Merritt, BC V1K1B8
- PROJECT
- SIZE
- ENGR
- MODIFIED
- DOCUMENT
- REV
- Copyright Sienci Labs 2024. This document describes Open Hardware and is licensed under the CERN-OHL-S v2. No warranty is implied or expressed.
- EMAIL: INFO@EXPATRIA.CA
- B
- /

### Library data of the parts
C1 C2 = 0603 100nF (104) 10% 50V: 50V 100nF X7R ±10% 0603 Multilayer Ceramic Capacitors MLCC - SMD/SMT ROHS; Manufacturer: YAGEO; Manufacturer Part Number: CC0603KRX7R9BB104; ComponentLink1Description: Supplier link; ComponentLink1URL: http://www.szlcsc.com/product/details_15331.html; Package: 0603; Supplier: LC; SuppliersPartNumber: C14663; Capacitance: 100nF; Tolerance: 10%; Voltage: 50V
R8 = 0603 10K (1002) 1%: Chip resistor; Manufacturer: Uniroyal Elec; Manufacturer Part Number: 0603WAF1002T5E; Power: 1/10W; ComponentLink1Description: Supplier link; ComponentLink1URL: http://www.szlcsc.com/product/details_26547.html; Package: 0603; Supplier: LC; SuppliersPartNumber: C25804; Resistance: 10KΩ; Tolerance: 1%
TP1-TP7 TP9 TP11 TP13-TP24 TP26 TP28 TP31-TP61 = TESTPOINT: Test Point; Manufacturer 1: N/A; Manufacturer Part Number 1: N/A; Value: Testpoint; Manufacturer: N/A; Manufacturer Part Number: N/A
U1 = SN74AHC1G86DBVR: XOR (Exclusive OR) IC 1 Channel  SOT-23-5; Manufacturer: Texas Instruments; Input Type: CMOS; Sub-Family: XOR Gate; Logic: True; F @ Nom Voltage(Max)(Mhz): 75; Schmitt Trigger: No; VCC(Min)(V): 2; Bits(#): 1; Voltage(Nom)(V): 3.3,5; VCC(Max)(V): 5.5; Rating: Catalog; ICC @ Nom Voltage(Max)(mA): 0.01; tpd @ Nom Voltage(Max)(ns): 14.5,8.8; Output Drive (IOL/IOH)(Max)(mA): 50/-50; Technology Family: AHC; Logic Function: XOR GATE,OR GATE; Propagation Delay: 10ns; Max Supply Voltage: 5.5V; Min Supply Voltage: 2V; Quiescent Current: 1uA; High Level Output Current: -8mA; Low Level Output Current: 8mA; Turn-On Delay Time: 14.5ns; DatasheetVersion: SCLS323N; Generic Part Number: SN74AHC1G86; Output Type: CMOS; PackageReference: DBV0005A; Gate Type: XOR; Operating Temperature Range(C): -40 to 125; 3-State Output: No; Manufacturer Part Number: SN74AHC1G86DBVR; Supplier 1: LCSC; Supplier Part Number 1: C7471; RoHS: Yes; Category: Logic Gates; Stock 1: 2465; Pricing 1: 5=0.121800, 50=0.098100, 150=0.086300, 500=0.077400, 3000=0.064100, 6000=0.060900 (USD); Mount: Surface Mount; Case/Package: SOT-23-5; Number of Pins: 5; Weight: 0.000557oz; Contact Plating: Tin,Matte; Min Operating Temperature: -40°C; Max Operating Temperature: 125°C; Number of Elements: 1; Number of Inputs: 2; Package Quantity: 3000; Packaging: Tape and Reel; Number of Circuits: 1; Number of Gates: 1; Number of Bits: 1; Series: 74AHC; Technology: CMOS; Number of Outputs: 1; Number of Input Lines: 2; Number of Output Lines: 1; Schmitt Trigger Input: No; Max Output Current: 8mA; Output Current: 8mA; Termination: SMD/SMT; Length: 2.9mm; Width: 1.6mm; Height: 1.15mm; Radiation Hardening: No; Lead Free: Lead Free; RoHS Compliant: Yes; Reach SVHC Compliant: Yes; ComponentLink1URL: https://datasheet.ciiva.com/7783/1767166-7783573.pdf?src-supplier=Element14; ComponentLink1Description: https://datasheet.ciiva.com/7783/1767166-7783573.pdf?src-supplier=Element14; ComponentLink2URL: https://datasheet.ciiva.com/14134/sn74ahc1g86-eng-tds-14134938.pdf?src-supplier=Distrelec; ComponentLink2Description: https://datasheet.ciiva.com/14134/sn74ahc1g86-eng-tds-14134938.pdf?src-supplier=Distrelec; ComponentLink3URL: https://datasheet.ciiva.com/46393/1882824-46393978.pdf?src-supplier=Element14; ComponentLink3Description: https://datasheet.ciiva.com/46393/1882824-46393978.pdf?src-supplier=Element14; ComponentLink4URL: https://datasheet.ciiva.com/1864/sn74ahc1g86-1864486.pdf?src-supplier=Digi-Key; ComponentLink4Description: https://datasheet.ciiva.com/1864/sn74ahc1g86-1864486.pdf?src-supplier=Digi-Key; ComponentLink5URL: https://datasheet.ciiva.com/1864/sn74ahc1g86-1864485.pdf?src-supplier=Digi-Key; ComponentLink5Description: https://datasheet.ciiva.com/1864/sn74ahc1g86-1864485.pdf?src-supplier=Digi-Key; ComponentLink6URL: https://datasheet.ciiva.com/1864/sn74ahc1g86-1864487.pdf?src-supplier=Digi-Key; ComponentLink6Description: https://datasheet.ciiva.com/1864/sn74ahc1g86-1864487.pdf?src-supplier=Digi-Key; ComponentLink7URL: https://datasheet.ciiva.com/14290/sn74ahc1g86-14290566.pdf?src-supplier=Avnet; ComponentLink7Description: https://datasheet.ciiva.com/14290/sn74ahc1g86-14290566.pdf?src-supplier=Avnet; ComponentLink8URL: https://datasheet.ciiva.com/15221/getdatasheetpartid-214959-15221947.pdf?src-supplier=Verical; ComponentLink8Description: https://datasheet.ciiva.com/15221/getdatasheetpartid-214959-15221947.pdf?src-supplier=Verical; ComponentLink9URL: https://datasheet.ciiva.com/14291/sn74ahc1g86-14291126.pdf?src-supplier=Avnet; ComponentLink9Description: https://datasheet.ciiva.com/14291/sn74ahc1g86-14291126.pdf?src-supplier=Avnet; ComponentLink10URL: https://datasheet.ciiva.com/48703/001074497-da-01-en-ic-sgl-2in-sn74ahc1g86dbvr-sot-23-5-tid-48703788.pdf?src-supplier=Conrad; ComponentLink10Description: https://datasheet.ciiva.com/48703/001074497-da-01-en-ic-sgl-2in-sn74ahc1g86dbvr-sot-23-5-tid-48703788.pdf?src-supplier=Conrad; SuppliersPartNumber: C7471; Supplier: LCSC

## Sheet MCU_STM32F412VGT6.SchDoc: STM32F412 CNC
size C; Author: AM; CompanyName: Expatria Technologies; DrawnBy: A.Marles; Engineer: AM; Organization: Expatria Technolgoies; Address1: PO Box 2084; Address3: Merritt, BC V1K 1B8; Address4: Canada; DocumentNumber: 5; Revision: B9; SheetNumber: 5; SheetTotal: 27
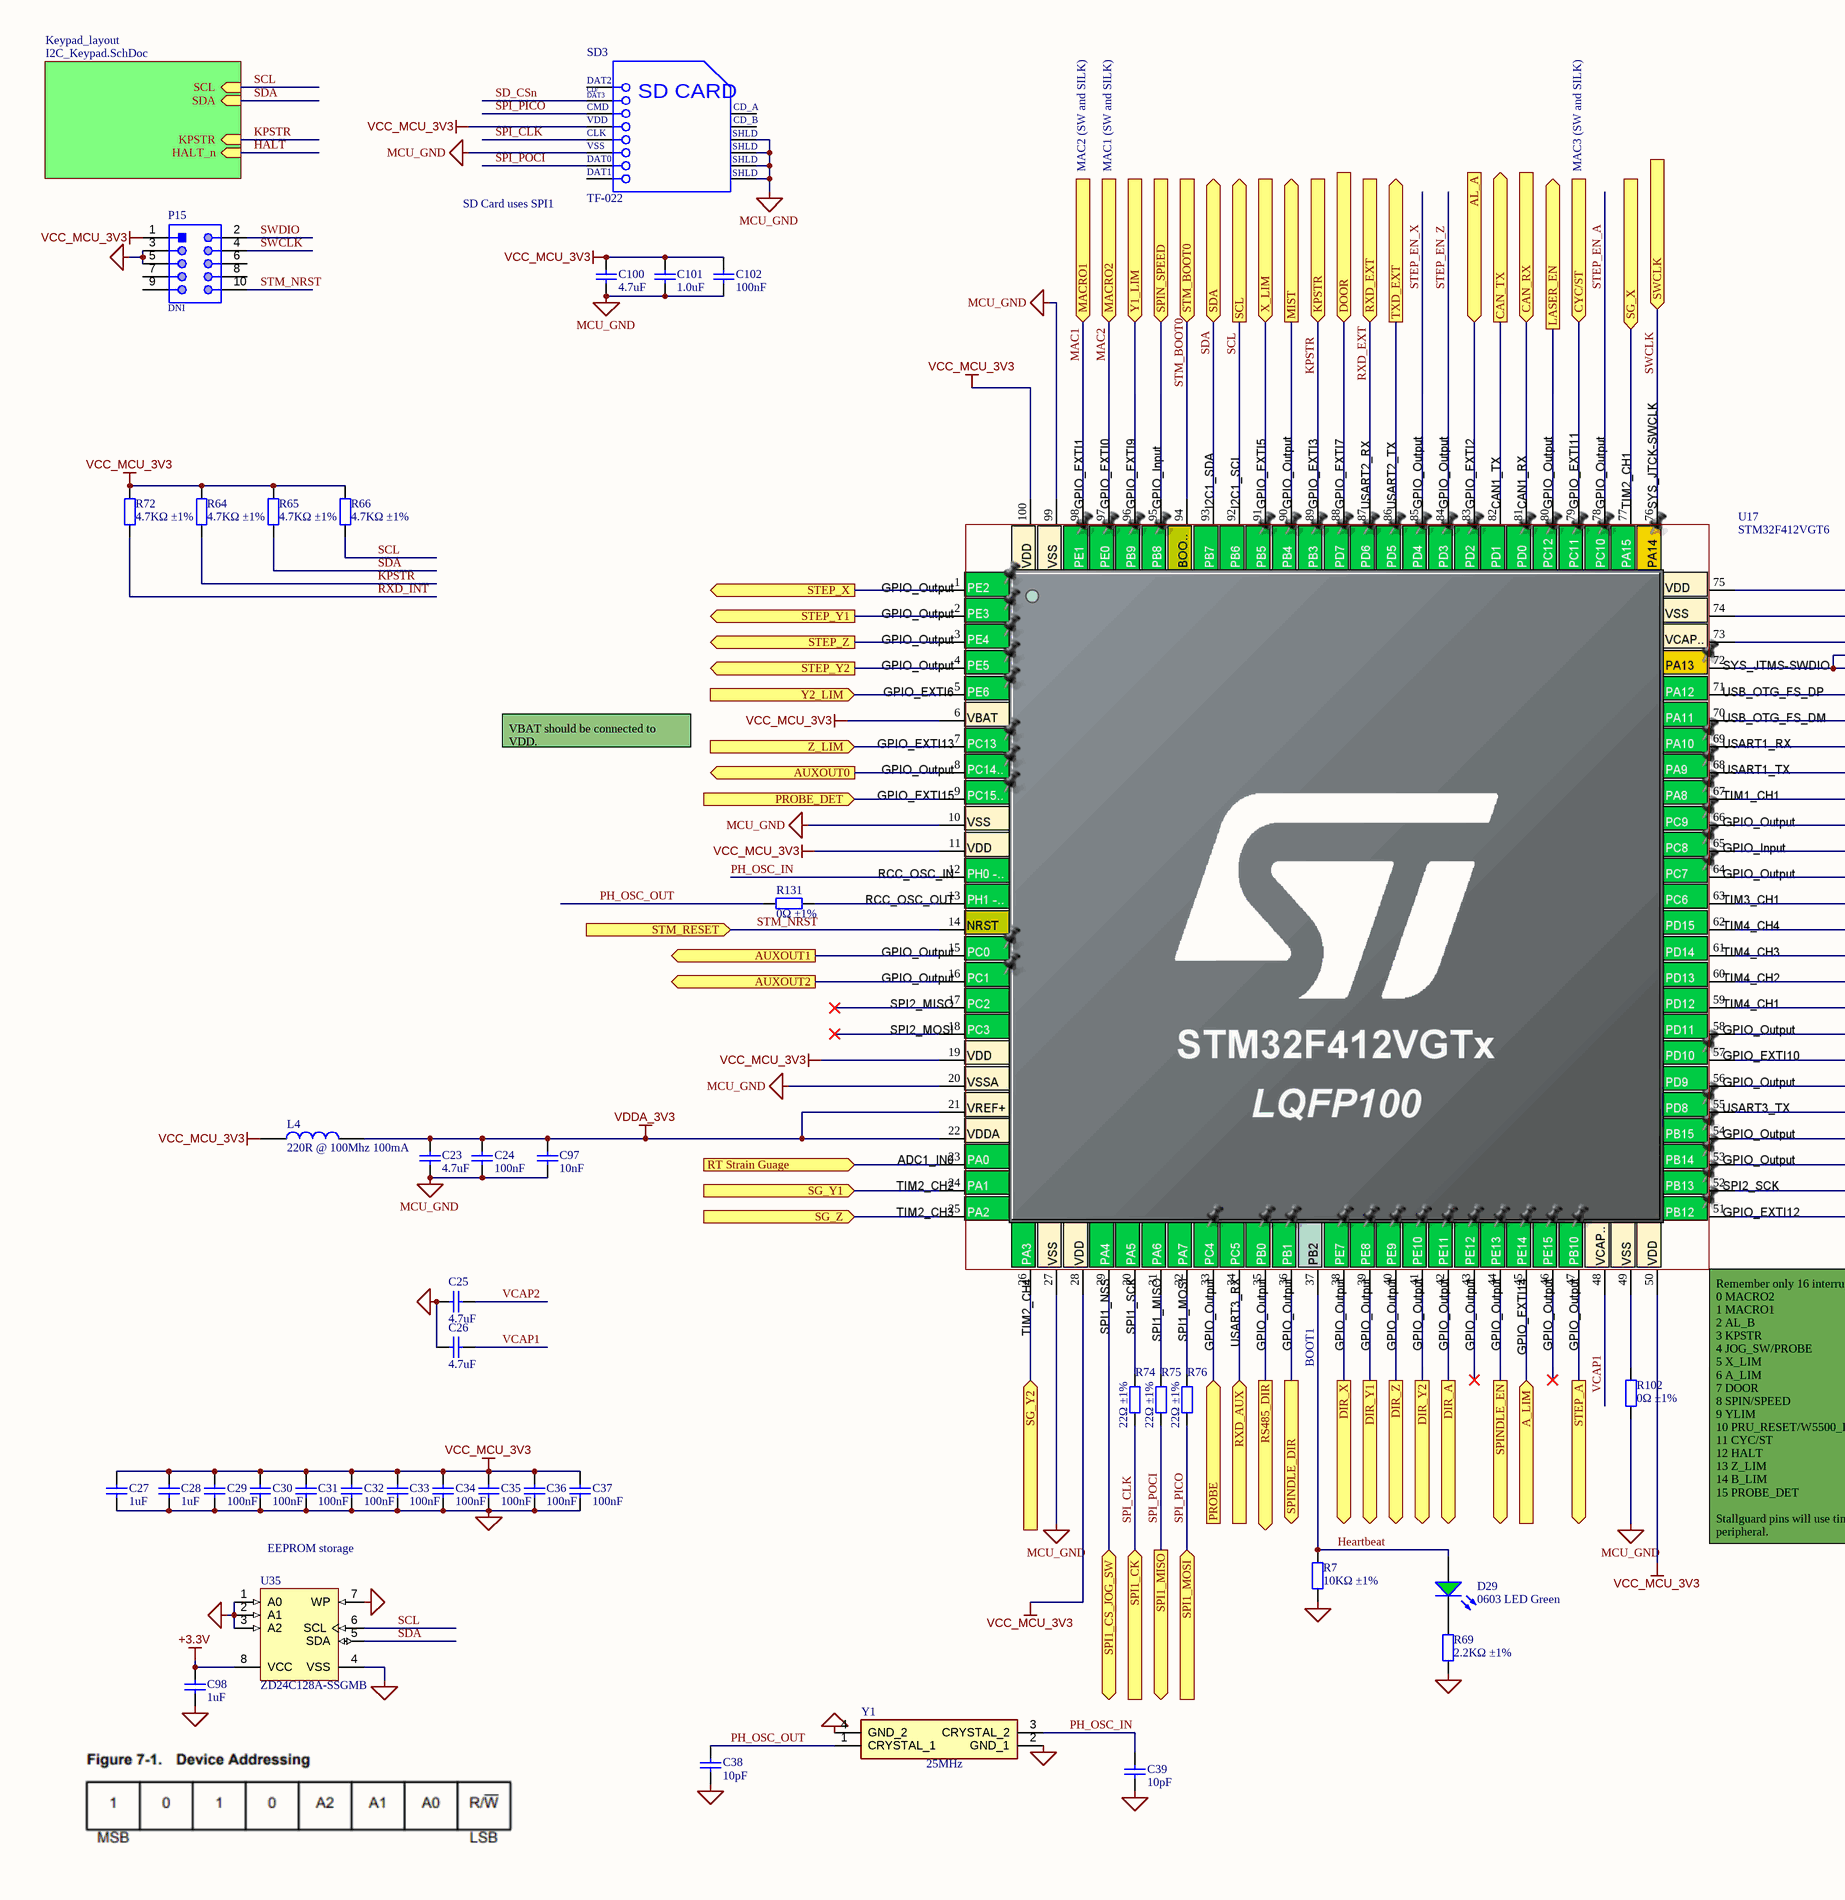
[diagram p3: MCU_STM32F412VGT6.SchDoc, left]
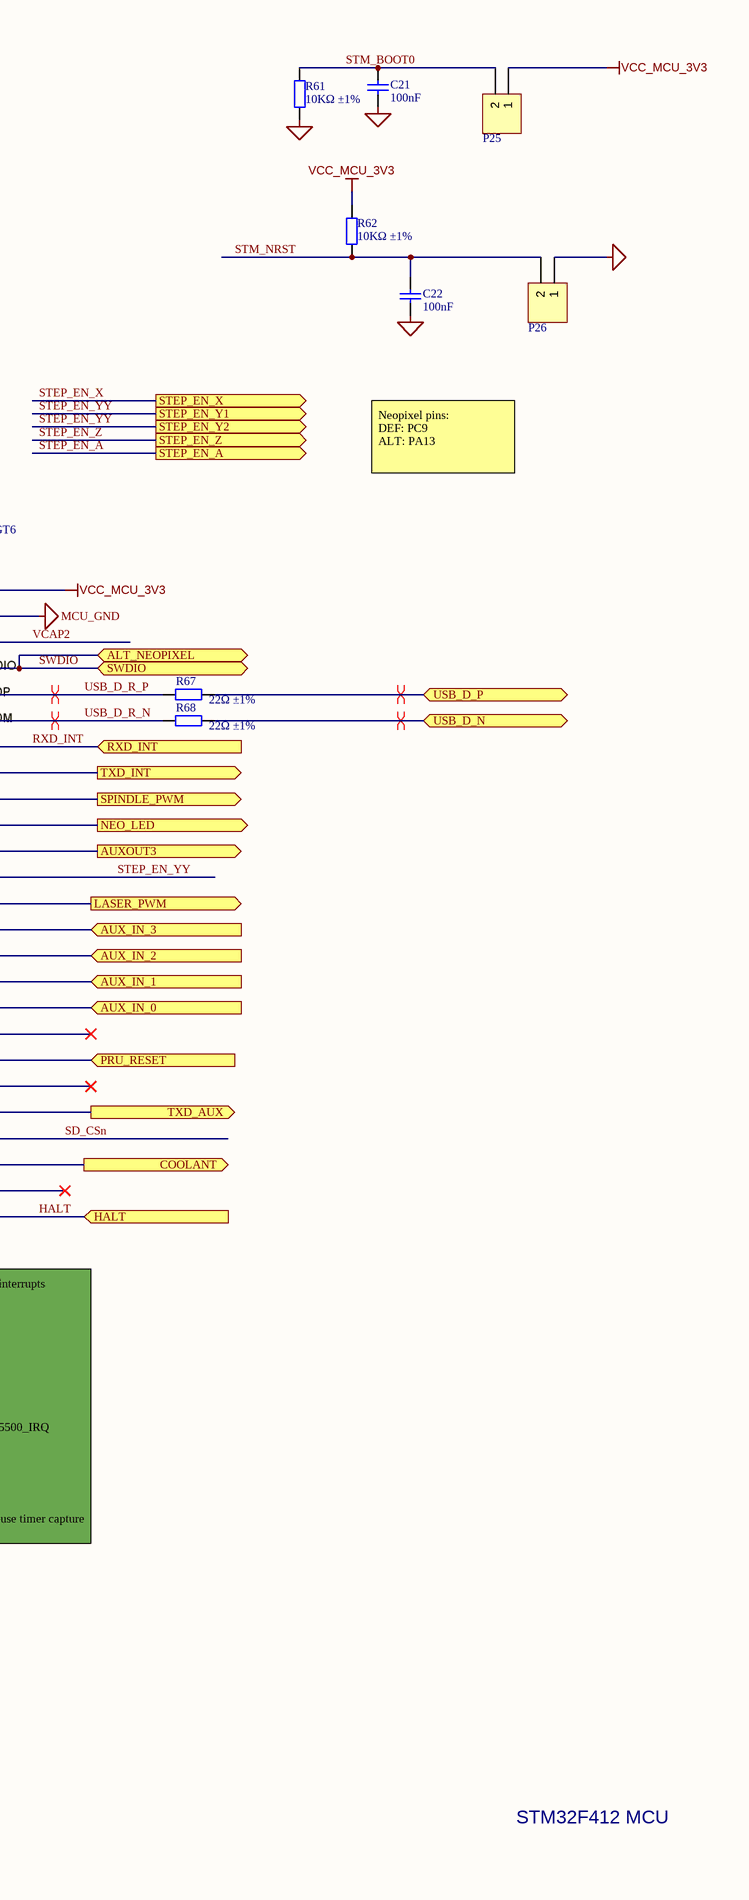
[diagram p4: MCU_STM32F412VGT6.SchDoc, right]

### Parts
C21  100nF  [0402_C]
C22  100nF  [0402_C]
C23  4.7uF  [0603_C]
C24  100nF  [0402_C]
C25  4.7uF  [0603_C]
C26  4.7uF  [0603_C]
C27  1uF  [0603_C]
C28  1uF  [0603_C]
C29  100nF  [0402_C]
C30  100nF  [0402_C]
C31  100nF  [0402_C]
C32  100nF  [0402_C]
C33  100nF  [0402_C]
C34  100nF  [0402_C]
C35  100nF  [0402_C]
C36  100nF  [0402_C]
C37  100nF  [0402_C]
C38  10pF  [0603_C]
C39  10pF  [0603_C]
C97  10nF  [0402_C]
C98  1uF  [0603_C]
C100  4.7uF  [0603_C]
C101  1.0uF  [0402_C]
C102  100nF  [0402_C]
D29  0603 LED Green  [0603_LED_S1 - GREEN]
L4  220R @ 100Mhz 100mA  [0402_L]
P15  DNI  [62201021121]
P25  Header 2  [HDR1X2]  (value not drawn)
P26  Header 2  [HDR1X2]  (value not drawn)
R7  10KΩ ±1%  [0402_R]
R61  10KΩ ±1%  [0402_R]
R62  10KΩ ±1%  [0402_R]
R64  4.7KΩ ±1%  [0402_R]
R65  4.7KΩ ±1%  [0402_R]
R66  4.7KΩ ±1%  [0402_R]
R67  22Ω ±1%  [0603_R]
R68  22Ω ±1%  [0603_R]
R69  2.2KΩ ±1%  [0402_R]
R72  4.7KΩ ±1%  [0402_R]
R74  22Ω ±1%  [0603_R]
R75  22Ω ±1%  [0603_R]
R76  22Ω ±1%  [0603_R]
R102  0Ω ±1%  [0603_R]
R131  0Ω ±1%  [0603_R]
SD3  TF-022  [MOLX-503398-1892_V]
U17  STM32F412VGT6  [QFP50P1600X1600X160-100N]
U35  ZD24C128A-SSGMB  [SOIC-SN8_L]
Y1  value 25MHz  [YSX321SL]  (hidden comment: TAXM25M4RDBCCT2T)

### Sub-sheets
Keypad_layout = I2C_Keypad.SchDoc: SCL (in), SDA (in), KPSTR (in), HALT_n (in)

### Ports
A_LIM (in), AL_A (in), ALT_NEOPIXEL (bidir), AUX_IN_0 (in), AUX_IN_1 (in), AUX_IN_2 (in), AUX_IN_3 (in), AUXOUT0 (out), AUXOUT1 (out), AUXOUT2 (out), AUXOUT3 (out), CAN_RX (in), CAN_TX (out), COOLANT (out), CYC/ST (in), DIR_A (out), DIR_X (out), DIR_Y1 (out), DIR_Y2 (out), DIR_Z (out), DOOR (in), HALT (in), KPSTR (in), LASER_EN (out), LASER_PWM (out), MACRO1 (in), MACRO2 (in), MIST (out), NEO_LED (out), PROBE (in), PROBE_DET (in), PRU_RESET (in), RS485_DIR (out), RT Strain Guage (in), RXD_AUX (in), RXD_EXT (in), RXD_INT (in), SCL (out), SDA (bidir), SG_X (in), SG_Y1 (in), SG_Y2 (in), SG_Z (in), SPI1_CK (in), SPI1_CS_JOG_SW (bidir), SPI1_MISO (out), SPI1_MOSI (in), SPIN_SPEED (in), SPINDLE_DIR (out), SPINDLE_EN (out), SPINDLE_PWM (out), STEP_A (out), STEP_EN_A (out), STEP_EN_X (out), STEP_EN_Y1 (out), STEP_EN_Y2 (out), STEP_EN_Z (out), STEP_X (out), STEP_Y1 (out), STEP_Y2 (out), STEP_Z (out), STM_BOOT0 (in), STM_RESET (in), SWCLK (in), SWDIO (bidir), TXD_AUX (out), TXD_EXT (out), TXD_INT (out), USB_D_N (bidir), USB_D_P (bidir), X_LIM (in), Y1_LIM (in), Y2_LIM (in), Z_LIM (in)

### Nets
MCU_GND: C21.1 C22.1 C23.1 C24.1 C25.1 C26.1 C27.1 C28.1 C29.1 C30.1 C31.1 C32.1 C33.1 C34.1 C35.1 C36.1 C37.1 C38.1 C39.1 C97.1 C98.1 C100.1 C101.1 C102.1 P15.3 P15.5 P26.1 R7.1 R61.2 R69.1 R102.1 SD3.6(VSS) SD3.11(SHLD) SD3.12(SHLD) SD3.13(SHLD) SD3.14(SHLD) U17.10(VSS) U17.20(VSSA) U17.27(VSS) U17.74(VSS) U17.99(VSS) U35.1(A0) U35.2(A1) U35.3(A2) U35.4(VSS) U35.7(WP) Y1.2(GND_1) Y1.4(GND_2)
VCC_MCU_3V3: C27.2 C28.2 C29.2 C30.2 C31.2 C32.2 C33.2 C34.2 C35.2 C36.2 C37.2 C98.2 C100.2 C101.2 C102.2 L4.1 P15.1 P25.1 R62.1 R64.2 R65.2 R66.2 R72.2 SD3.4(VDD) U17.6(VBAT) U17.11(VDD) U17.19(VDD) U17.28(VDD) U17.50(VDD) U17.75(VDD) U17.100(VDD) U35.8(VCC)  [also labelled +3.3V]
VDDA_3V3: C23.2 C24.2 C97.2 L4.2 U17.21(VREF+) U17.22(VDDA)
A_LIM: U17.45(PE14) ; port A_LIM
AL_A: U17.83(PD2) ; port AL_A
ANALOG_IN: U17.23(PA0) ; port RT Strain Guage
AUX_IN_0: U17.59(PD12) ; port AUX_IN_0
AUX_IN_1: U17.60(PD13) ; port AUX_IN_1
AUX_IN_2: U17.61(PD14) ; port AUX_IN_2
AUX_IN_3: U17.62(PD15) ; port AUX_IN_3
AUXOUT_0: U17.8(PC14) ; port AUXOUT0
AUXOUT_1: U17.15(PC0) ; port AUXOUT1
AUXOUT_2: U17.16(PC1) ; port AUXOUT2
AUXOUT_3: U17.65(PC8) ; port AUXOUT3
CAN_RX: U17.81(PD0) ; port CAN_RX
CAN_TX: U17.82(PD1) ; port CAN_TX
COOLANT: U17.53(PB14) ; port COOLANT
CYC/ST: U17.79(PC11) ; port CYC/ST
DIR: U17.35(PB0) ; port RS485_DIR
DIR_A: U17.42(PE11) ; port DIR_A
DIR_X: U17.38(PE7) ; port DIR_X
DIR_Y1: U17.39(PE8) ; port DIR_Y1
DIR_Y2: U17.41(PE10) ; port DIR_Y2
DIR_Z: U17.40(PE9) ; port DIR_Z
DOOR: U17.88(PD7) ; port DOOR
HALT: U17.51(PB12) ; port HALT, sheet Keypad_layout/HALT_n  [project net HALT_n]
Heartbeat: D29.A R7.2 U17.37(PB2)
KPSTR: R64.1 U17.89(PB3) ; port KPSTR, sheet Keypad_layout/KPSTR
LASER_EN: U17.80(PC12) ; port LASER_EN
Laser_PWM: U17.63(PC6) ; port LASER_PWM
LED Control: U17.66(PC9) ; port NEO_LED
MAC1: U17.98(PE1) ; port MACRO1
MAC2: U17.97(PE0) ; port MACRO2
MIST: U17.90(PB4) ; port MIST
PH_OSC_IN: C39.2 U17.12(PH0) Y1.3(CRYSTAL_2)
PH_OSC_OUT: C38.2 R131.2 Y1.1(CRYSTAL_1)
PRB_TLO: U17.9(PC15) ; port PROBE_DET
PROBE: U17.33(PC4) ; port PROBE
PRU_RESET: U17.57(PD10) ; port PRU_RESET
RXD_AUX: U17.34(PC5) ; port RXD_AUX
RXD_EXT: U17.87(PD6) ; port RXD_EXT  [project net RXD]
RXD_INT: R72.1 U17.69(PA10) ; port RXD_INT
SCL: R66.1 U17.92(PB6) U35.6(SCL) ; port SCL, sheet Keypad_layout/SCL
SD_CSn: SD3.2(CD/DAT3) U17.54(PB15)
SDA: R65.1 U17.93(PB7) U35.5(SDA) ; port SDA, sheet Keypad_layout/SDA
SG_X: U17.77(PA15) ; port SG_X
SG_Y1: U17.24(PA1) ; port SG_Y1
SG_Y2: U17.26(PA3) ; port SG_Y2
SG_Z: U17.25(PA2) ; port SG_Z
SPI_CLK: R74.2 SD3.5(CLK) ; port SPI1_CK  [project net SBC_SPI_CLK]
SPI_CS_JOG_SW: U17.29(PA4) ; port SPI1_CS_JOG_SW
SPI_PICO: R76.2 SD3.3(CMD) ; port SPI1_MOSI  [project net SBC_SPI_PICO]
SPI_POCI: R75.2 SD3.7(DAT0) ; port SPI1_MISO  [project net SBC_SPI_POCI]
SPINDLE_AT_SPEED: U17.95(PB8) ; port SPIN_SPEED
SPINDLE_DIR: U17.36(PB1) ; port SPINDLE_DIR
SPINDLE_EN: U17.44(PE13) ; port SPINDLE_EN
SPINDLE_PWM: U17.67(PA8) ; port SPINDLE_PWM
STEP_A: U17.47(PB10) ; port STEP_A
STEP_EN_A: U17.78(PC10) ; port STEP_EN_A
STEP_EN_X: U17.85(PD4) ; port STEP_EN_X  [project net ENN_X]
STEP_EN_YY: U17.64(PC7) ; port STEP_EN_Y1, port STEP_EN_Y2  [project net ENN_Y1]
STEP_EN_Z: U17.84(PD3) ; port STEP_EN_Z  [project net ENN_Z]
STEP_X: U17.1(PE2) ; port STEP_X
STEP_Y1: U17.2(PE3) ; port STEP_Y1
STEP_Y2: U17.4(PE5) ; port STEP_Y2
STEP_Z: U17.3(PE4) ; port STEP_Z
STM_BOOT0: C21.2 P25.2 R61.1 U17.94(BOOT0) ; port STM_BOOT0
STM_NRST: C22.2 P15.10 P26.2 R62.2 U17.14(NRST) ; port STM_RESET  [project net STM_RESET]
SWCLK: P15.4 U17.76(PA14) ; port SWCLK
SWDIO: P15.2 U17.72(PA13) ; port SWDIO, port ALT_NEOPIXEL
TXD: U17.86(PD5) ; port TXD_EXT
TXD_AUX: U17.55(PD8) ; port TXD_AUX
TXD_INT: U17.68(PA9) ; port TXD_INT
USB_D_N: R68.2 ; port USB_D_N
USB_D_P: R67.2 ; port USB_D_P
USB_D_R_N: R68.1 U17.70(PA11)
USB_D_R_P: R67.1 U17.71(PA12)
VCAP1: C26.2 U17.48(VCAP1)
VCAP2: C25.2 U17.73(VCAP2)
X_LIM: U17.91(PB5) ; port X_LIM
Y2_LIM: U17.5(PE6) ; port Y2_LIM
Y_LIM: U17.96(PB9) ; port Y1_LIM
Z_LIM: U17.7(PC13) ; port Z_LIM
NetD29_K: D29.K R69.2
NetR74_1: R74.1 U17.30(PA5)
NetR75_1: R75.1 U17.31(PA6)
NetR76_1: R76.1 U17.32(PA7)
NetR102_2: R102.2 U17.49(VSS)
NetR131_1: R131.1 U17.13(PH1)

Not connected (* = marked no-connect by the designer): P15 6 7 8 9; SD3 1(DAT2) 8(DAT1) 9(CD_A) 10(CD_B); U17 17(PC2)* 18(PC3)* 43(PE12)* 46(PE15)* 52(PB13)* 56(PD9)* 58(PD11)*

### Layout directives
differential pair: USB_D_N, USB_D_P, USB_D_R_N, USB_D_R_P

### Notes on the sheet
- SD Card uses SPI1
- MAC2 (SW and SILK)
- MAC1 (SW and SILK)
- MAC3 (SW and SILK)
- Neopixel pins:
  DEF: PC9
  ALT: PA13
- VBAT should be connected to VDD.
- BOOT1
- EEPROM storage
- (near U17) Remember only 16 interrupts
  0 MACRO2
  1 MACRO1
  2 AL_B
  3 KPSTR
  4 JOG_SW/PROBE
  5 X_LIM
  6 A_LIM
  7 DOOR
  8 SPIN/SPEED
  9 YLIM
  10 PRU_RESET/W5500_IRQ
  11 CYC/ST
  12 HALT
  13 Z_LIM
  14 B_LIM
  15 PROBE_DET
  Stallguard pins will use timer capture peripheral.
- STM32F412 MCU
- Expatria Technologies
- SHEET
- PROJECT
- REV
- EMAIL: INFO@EXPATRIA.CA
- 625 Kane Valley Rd.
- Box 2084
- Merritt, BC V1K1B8
- SIZE
- ENGR
- C
- MODIFIED
- DOCUMENT
- /
- Copyright Sienci Labs 2024. This document describes Open Hardware and is licensed under the CERN-OHL-S v2. No warranty is implied or expressed.
- (in symbol TF-022) CD/; DAT3; SD CARD

### Library data of the parts
C21 C22 C24 C29-C37 C102 = 0402 100nF (104) 10% 16V: 16V 100nF X7R ±10% 0402 Multilayer Ceramic Capacitors MLCC - SMD/SMT ROHS; Manufacturer: Samsung Electro-Mechanics; Manufacturer Part Number: CL05B104KO5NNNC; ComponentLink1Description: Supplier link; ComponentLink1URL: http://www.szlcsc.com/product/details_1877.html; Package: 0402; Supplier: LC; SuppliersPartNumber: C1525; Capacitance: 100nF; Tolerance: 10%; Voltage: 16V
C23 C25 C26 C100 = 0603 4.7uF (475) 10% 16V: 16V 4.7uF X5R ±10% 0603 Multilayer Ceramic Capacitors MLCC - SMD/SMT ROHS; Manufacturer: Samsung Electro-Mechanics; Manufacturer Part Number: CL10A475KO8NNNC; ComponentLink1Description: Supplier link; ComponentLink1URL: http://www.szlcsc.com/product/details_20375.html; Package: 0603; Supplier: LC; SuppliersPartNumber: C19666; Capacitance: 4.7uF; Tolerance: 10%; Voltage: 16V
C27 C28 C98 = 0603 1uF (105) 10% 50V: Chip capacitors; Manufacturer: Samsung Electro-Mechanics; Manufacturer Part Number: CL10A105KB8NNNC; Tolerance: 10%; Voltage: 50V; ComponentLink1Description: Supplier link; ComponentLink1URL: http://www.szlcsc.com/product/details_16531.html; Package: 0603; Supplier: LCSC; SuppliersPartNumber: C15849; Capacitance: 1uF
C38 C39 = 0603 10pF (100) 5% 50V: Chip capacitors; Manufacturer: Samsung Electro-Mechanics; Manufacturer Part Number: CL10C100JB8NNNC; Tolerance: 5%; Voltage: 50V; ComponentLink1Description: Supplier link; ComponentLink1URL: http://www.szlcsc.com/product/details_1986.html; Package: 0603; Supplier: LCSC; SuppliersPartNumber: C1634; Capacitance: 10pF
C97 = 0402 10nF (103) 10% 50V: Chip capacitors; Manufacturer: Samsung Electro-Mechanics; Manufacturer Part Number: CL05B103KB5NNNC; Tolerance: 10%; Voltage: 50V; ComponentLink1Description: Supplier link; ComponentLink1URL: http://www.szlcsc.com/product/details_15869.html; Package: 0402; Supplier: LC; SuppliersPartNumber: C15195; Capacitance: 10nF
C101 = 0402 1.0uF (105) 10% 25V: Chip capacitor; Manufacturer: Samsung Electro-Mechanics; Manufacturer Part Number: CL05A105KA5NQNC; Capacitance: 1uF; Tolerance: 10%; Voltage: 25V; ComponentLink1Description: Supplier link; ComponentLink1URL: http://www.szlcsc.com/product/details_53938.html; Package: 0402; Supplier: LC; SuppliersPartNumber: C52923
D29 = MHT192UGCT: 20mA -40℃~+85℃ 515nm~530nm Emerald 120° 60mW 0603 Light Emitting Diodes (LED) ROHS; Manufacturer: MEIHUA; Package: 0603; Supplier: LC; SuppliersPartNumber: C389519; Color: Green; Manufacturer Part Number: MHT192UGCT
L4 = 0402 220R@100Mhz 0.1A: 700mΩ ±25% 220Ω@100MHz 0402 Ferrite Beads ROHS; Manufacturer Part Number: CBG100505U221T; Manufacturer: FH (Guangdong Fenghua Advanced Tech); Package: 0402; Supplier: LC; SuppliersPartNumber: C92617
P15 = B-2101S10P-B110: Straight Square Pins 1mm 10P 3mm -40℃~+105℃ 1.8mm 1.27mm Black 1.27mm 2x5P Plugin,P=1.27mm Pin Headers ROHS; Manufacturer: Ckmtw(Shenzhen Cankemeng); Manufacturer Part Number: B-2101S10P-B110; Supplier 1: LCSC; SuppliersPartNumber: C2895038; RoHS: No
P25 P26 = Header 2: Straight Square Pins 2 2.54mm Black Brass 1x2P Plugin,P=2.54mm Pin Headers ROHS; Manufacturer: MOLEX; Manufacturer Part Number: 22284020; Publisher: Altium Limited; LatestRevisionDate: 17-Jul-2002; LatestRevisionNote: Re-released for DXP Platform.; SuppliersPartNumber: C234182; Supplier 1: LCSC; Supplier Part Number 1: C234182
R7 R61 R62 = 0402 10K (1002) 1%: Chip resistor; Manufacturer: Uniroyal Elec; Manufacturer Part Number: 0402WGF1002TCE; Power: 1/16W; ComponentLink1Description: Supplier link; ComponentLink1URL: http://www.szlcsc.com/product/details_26487.html; Package: 0402; Supplier: LC; SuppliersPartNumber: C25744; Resistance: 10KΩ; Tolerance: 1%
R64-R66 R72 = 0402 4.7K (4701) 1%: Chip resistor; Manufacturer: Uniroyal Elec; Manufacturer Part Number: 0402WGF4701TCE; Power: 1/16W; ComponentLink1Description: Supplier link; ComponentLink1URL: http://www.szlcsc.com/product/details_26643.html; Package: 0402; Supplier: LC; SuppliersPartNumber: C25900; Resistance: 4.7KΩ; Tolerance: 1%
R67 R68 R74-R76 = 0603 22R (22R0) 1%: Chip resistor; Manufacturer: Uniroyal Elec; Manufacturer Part Number: 0603WAF220JT5E; Power: 1/10W; ComponentLink1Description: Supplier link; ComponentLink1URL: http://www.szlcsc.com/product/details_24078.html; Package: 0603; Supplier: LCSC; SuppliersPartNumber: C23345; Resistance: 22Ω; Tolerance: 1%
R69 = 0402 2.2K (2201) 1%: Chip resistor; Manufacturer: Uniroyal Elec; Manufacturer Part Number: 0402WGF2201TCE; Power: 1/16W; ComponentLink1Description: Supplier link; ComponentLink1URL: http://www.szlcsc.com/product/details_26622.html; Package: 0402; Supplier: LC; SuppliersPartNumber: C25879; Resistance: 2.2KΩ; Tolerance: 1%
R102 R131 = 0603 0R (0R0) 1%: Chip resistor; Manufacturer: Uniroyal Elec; Manufacturer Part Number: 0603WAF0000T5E; Power: 1/10W; ComponentLink1Description: Supplier link; ComponentLink1URL: http://www.szlcsc.com/product/details_21903.html; Package: 0603; Supplier: LC; SuppliersPartNumber: C21189; Resistance: 0Ω; Tolerance: 1%
SD3 = TF-022: -40℃~+85℃ 1.28mm Gold plating Deck MicroSD card (TF card) Self bomb SMD SD Card Connectors ROHS; Manufacturer: Hanbo Electronic; SuppliersPartNumber: C2962373; Manufacturer Part Number: TF-022; Value: TF-022
U17 = STM32F412VGT6: LQFP-100(14x14) Microcontroller Units (MCUs/MPUs/SOCs) ROHS; Manufacturer: STMicroelectronics; Height: 1.6mm; Datasheet Link: https://4donline.ihs.com/images/VipMasterIC/IC/SGST/SGST-S-A0004202317/SGST-S-A0004202317-1.pdf?hkey=6D3A4C79FDBF58556ACFDE234799DDF0; Manufacturer_Part_Number: STM32F412VGT6; SuppliersPartNumber: C727951; Supplier: LCSC; Manufacturer Part Number: STM32F412VGT6; Value: STM32F412VGT6
U35 = CMP-0159-00216-1: IC EEPROM 128KBIT I2C 8SOIC; Manufacturer: Zetta; SuppliersPartNumber: C918271; Manufacturer Part Number: ZD24C128A-SSGMB
Y1 = TAXM25M4RDBCCT2T: 25MHz 10pF ±10ppm SMD3225-4P Crystals ROHS; Manufacturer_Name: TAE(Zhejiang Abel Elec); Height: 0.8mm; Manufacturer_Part_Number: TAXM25M4RDBCCT2T; SuppliersPartNumber: C403946; Supplier 1: LCSC; Supplier Part Number 1: C403946; Manufacturer 1: TAE(Zhejiang Abel Elec); Manufacturer Part Number 1: TAXM25M4RDBCCT2T; Manufacturer: TAE(Zhejiang Abel Elec); Manufacturer Part Number: TAXM25M4RDBCCT2T

## Sheet I2C_Keypad.SchDoc: STM32F412 CNC
size B; Author: AM; CompanyName: Expatria Technologies; DrawnBy: A.Marles; Engineer: AM; Organization: Expatria Technolgoies; Address1: PO Box 2084; Address3: Merritt, BC V1K 1B8; Address4: Canada; DocumentNumber: 6; Revision: B9; SheetNumber: 6; SheetTotal: 27
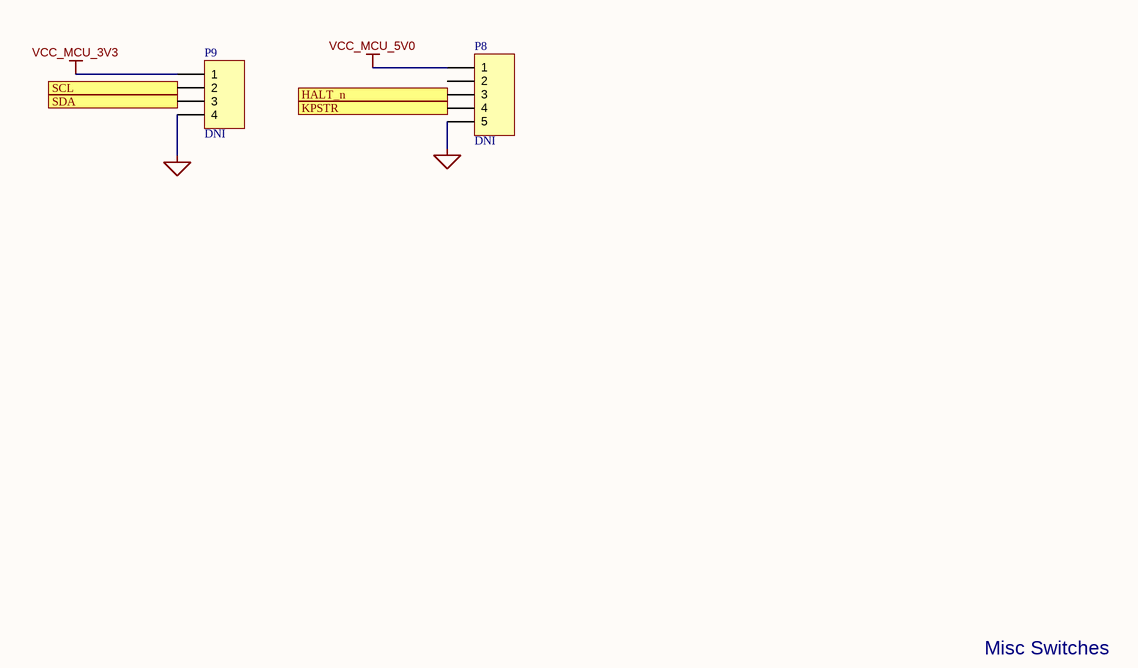
[diagram p5: I2C_Keypad.SchDoc]

### Parts
P8  DNI  [HDR1X5]
P9  DNI  [HDR1X4]

### Ports
HALT_n (out), KPSTR (out), SCL (in), SDA (in)

### Nets
MCU_GND: P8.5 P9.4
VCC_MCU_3V3: P9.1
VCC_MCU_5V0: P8.1
HALT_n: P8.3 ; port HALT_n
KPSTR: P8.4 ; port KPSTR
SCL: P9.2 ; port SCL
SDA: P9.3 ; port SDA

Not connected (* = marked no-connect by the designer): P8 2

### Notes on the sheet
- Misc Switches
- SHEET
- Expatria Technologies
- 625 Kane Valley Rd.
- Box 2084
- Merritt, BC V1K1B8
- PROJECT
- SIZE
- ENGR
- MODIFIED
- DOCUMENT
- REV
- Copyright Sienci Labs 2024. This document describes Open Hardware and is licensed under the CERN-OHL-S v2. No warranty is implied or expressed.
- EMAIL: INFO@EXPATRIA.CA
- B
- /

### Library data of the parts
P8 = Header 5: Header, 5-Pin; LatestRevisionDate: 17-Jul-2002; LatestRevisionNote: Re-released for DXP Platform.; Publisher: Altium Limited; SuppliersPartNumber: C124379; Supplier: LCSC
P9 = Header 4: Header, 4-Pin; Publisher: Altium Limited; SuppliersPartNumber: C124378; Supplier: LCSC